# Altium project CT310高端控制盒核心板电路V1.2.PRJPCB
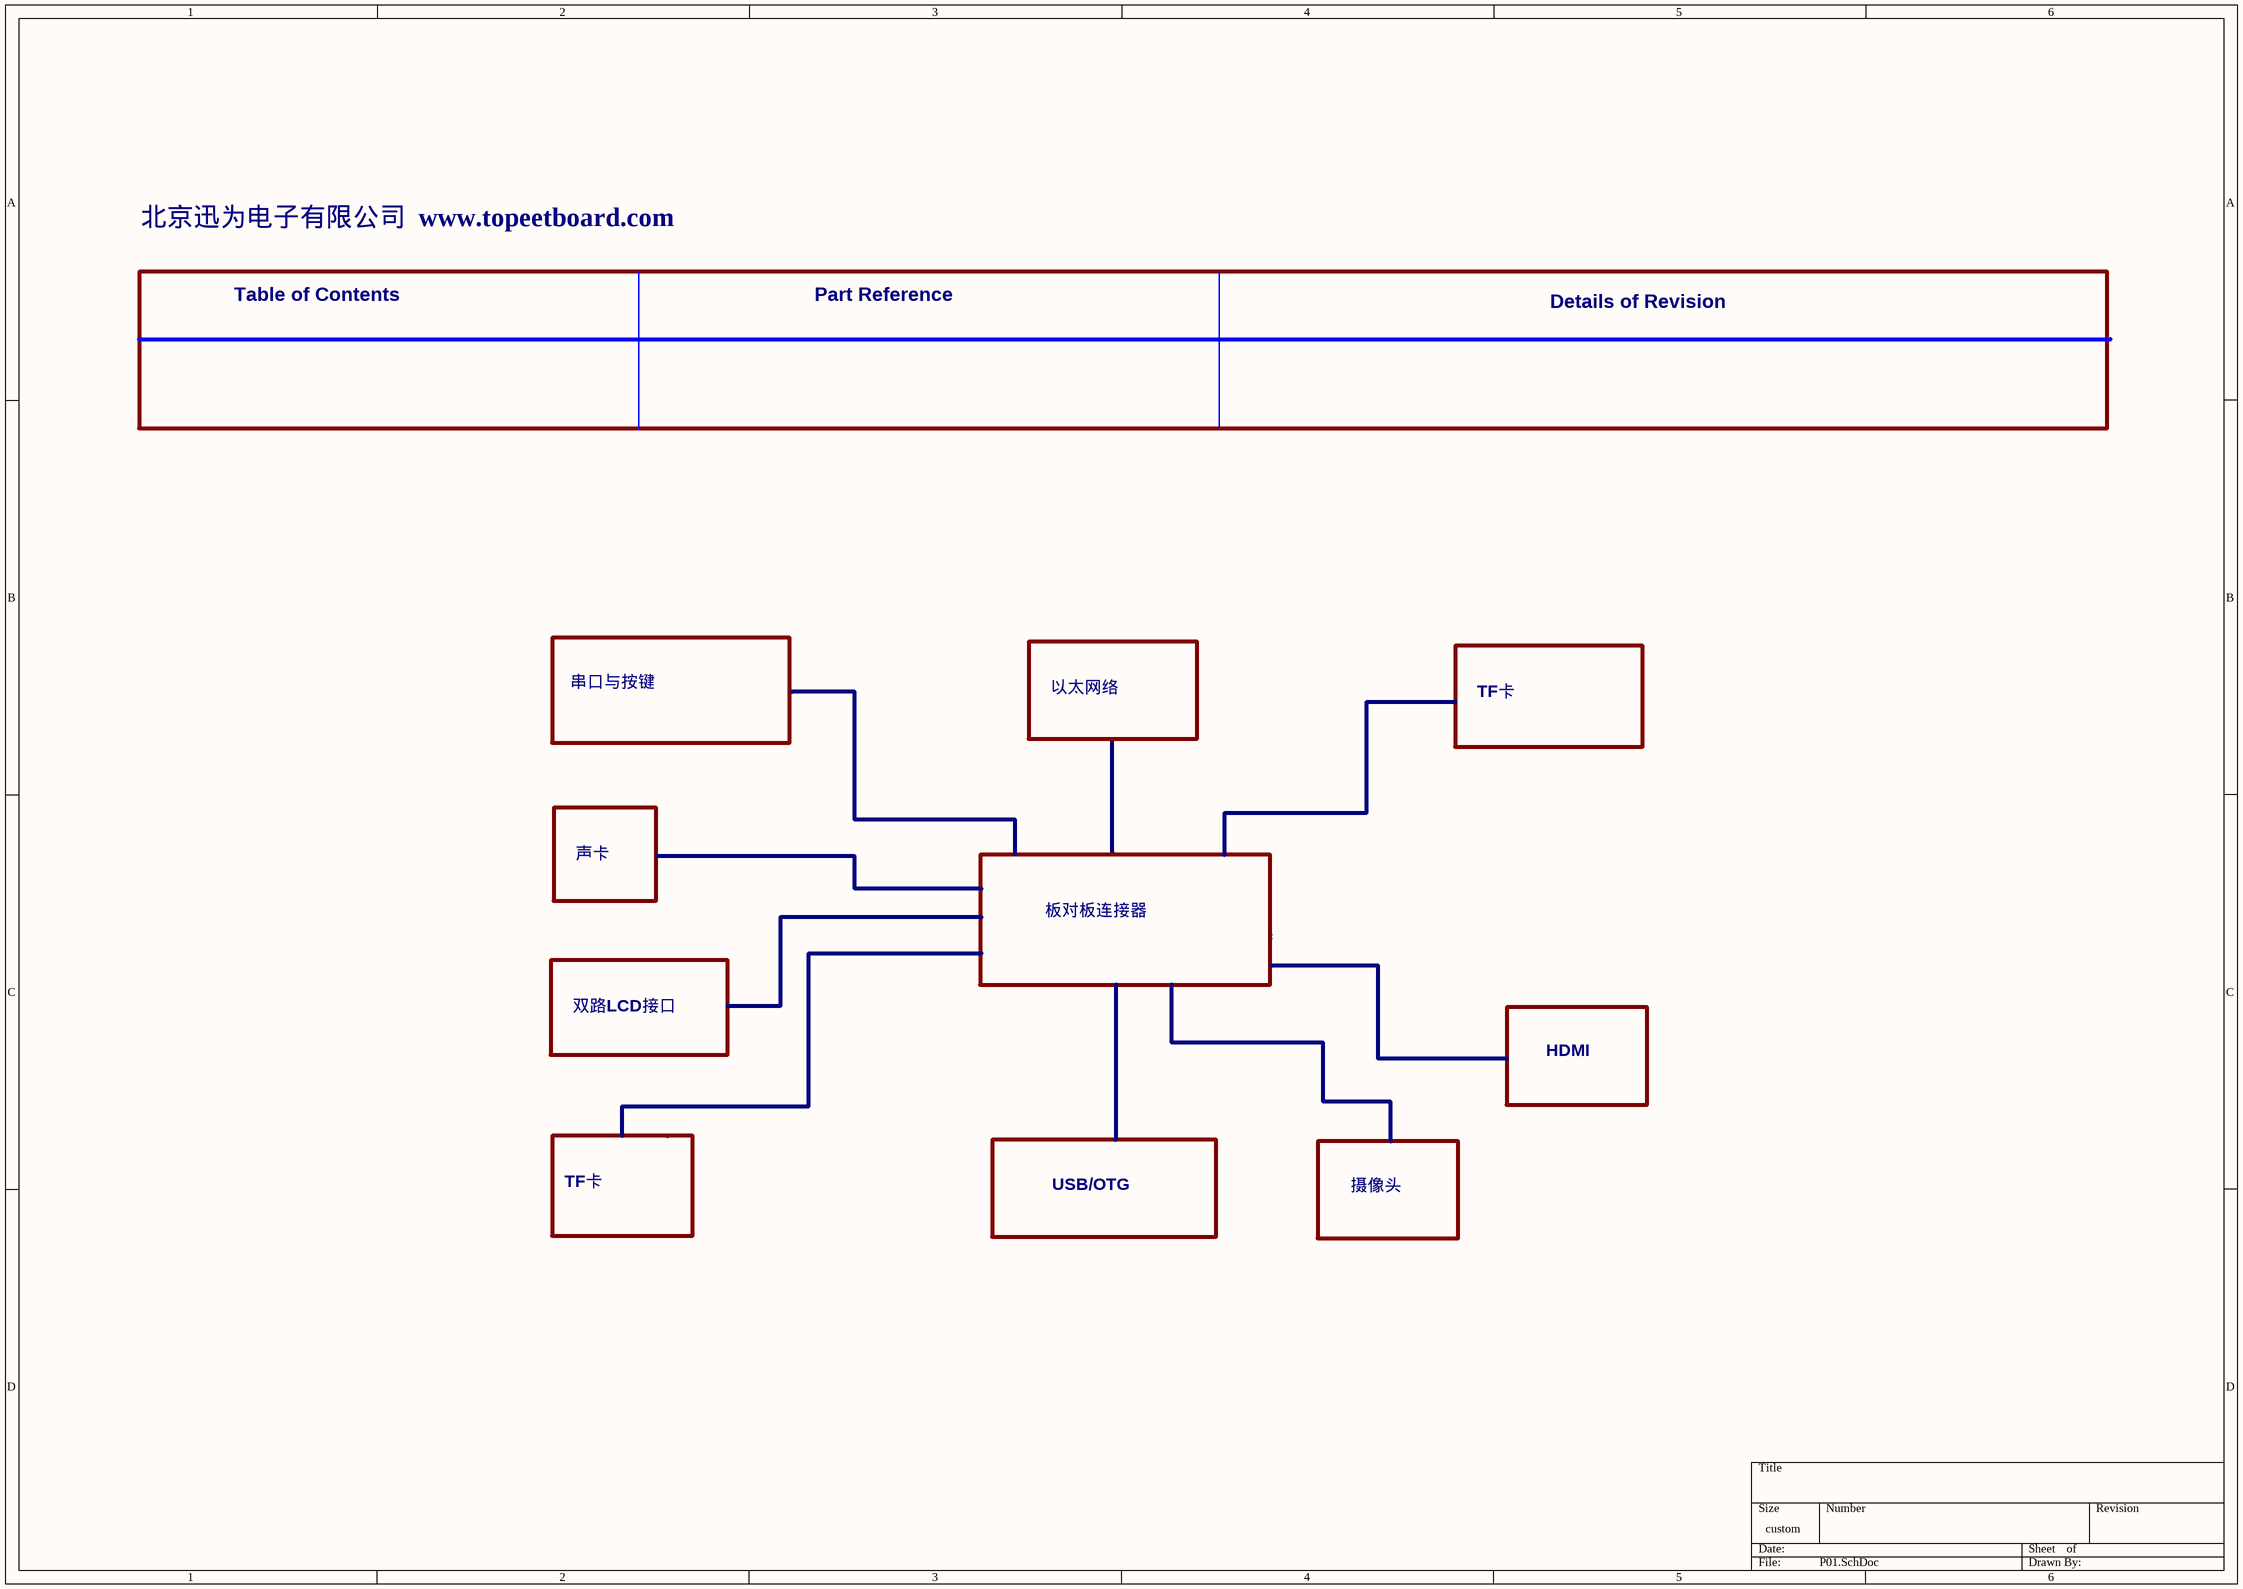
[diagram p0: P01.SchDoc]
9 sheets, 194 parts. Net scope: global (net labels, ports and power ports of the same name join across sheets).
Board file: CT310高端控制盒核心板电路V1.2.PcbDoc
Sheets:
  P01.SchDoc
  P02-DC_JACK.SchDoc
  P03-UARTs_KEY.SchDoc
  P04-NET.SchDoc
  P07-LCD.SchDoc
  P09-USB_JTAG.SchDoc
  P11-CAMERA AVIN.SchDoc
  P15-EXP_IO.SchDoc
  P16-Connector.SchDoc

## Sheet P01.SchDoc
size 420 x 297 mm

### Notes on the sheet
- 北京迅为电子有限公司  www.topeetboard.com
- Table of Contents
- Part Reference
- Details of Revision
- 串口与按键
- 以太网络
- TF卡
- 声卡
- 板对板连接器
- 双路LCD接口
- HDMI
- USB/OTG
- 摄像头

## Sheet P02-DC_JACK.SchDoc
size 594 x 420 mm
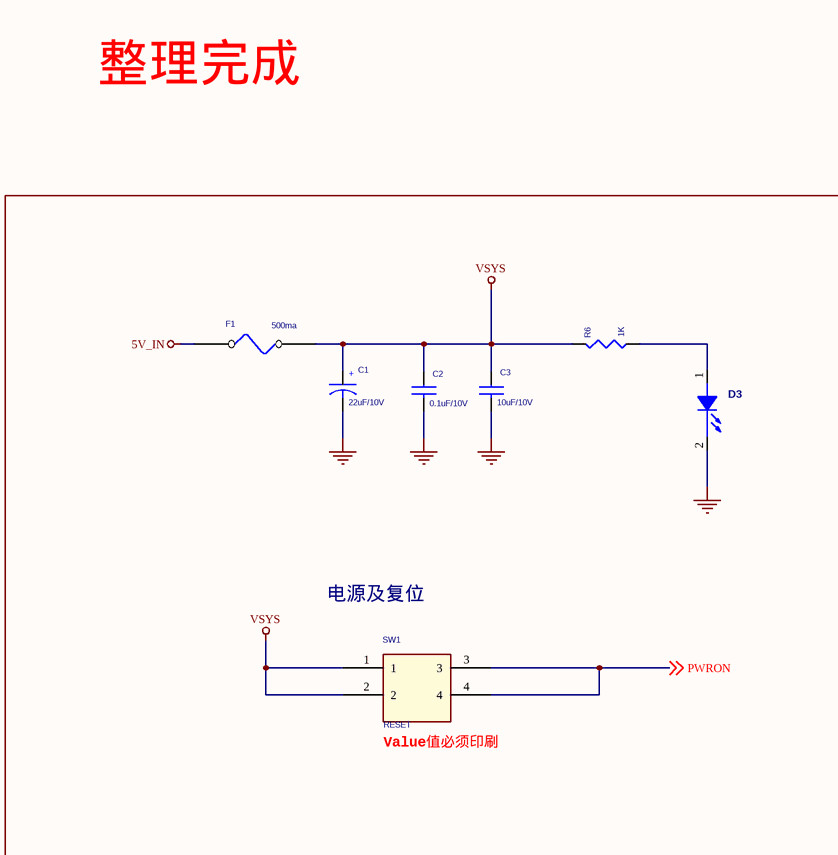
[diagram p1: P02-DC_JACK.SchDoc, top left]
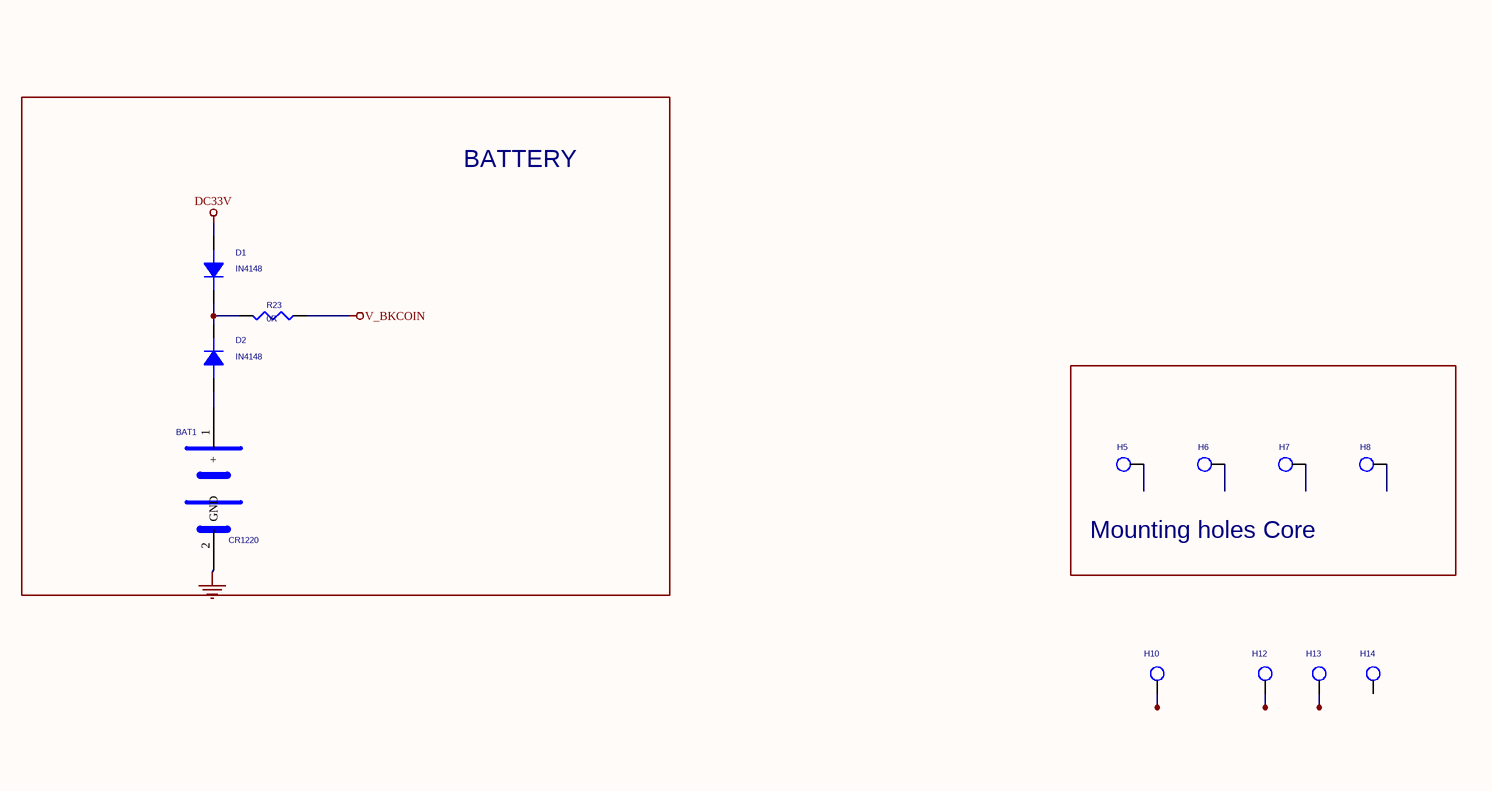
[diagram p2: P02-DC_JACK.SchDoc, top right]
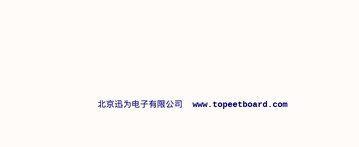
[diagram p3: P02-DC_JACK.SchDoc, bottom right]

### Parts
BAT1  CR1220  [BAT1]
C1  22uF/10V  [C1206-S]
C2  0.1uF/10V  [C0603-S]
C3  10uF/10V  [C0603-S]
D1  IN4148  [D1206]
D2  IN4148  [D1206]
D3  LED-Red (SMD 2012)  [LED0603]  (value not drawn)
F1  500ma  [F1812]
H5  TP_P0_0.8_D0  [HOLE2_7]  (value not drawn)
H6  TP_P0_0.8_D0  [hole2_7]  (value not drawn)
H7  TP_P0_0.8_D0  [hole2_7]  (value not drawn)
H8  TP_P0_0.8_D0  [hole2_7]  (value not drawn)
H10  TP_P0_0.8_D0  [HOLE2_7]  (value not drawn)
H12  TP_P0_0.8_D0  [HOLE2_7]  (value not drawn)
H13  TP_P0_0.8_D0  [HOLE2_7]  (value not drawn)
H14  TP_P0_0.8_D0  [HOLE2_7]  (value not drawn)
R6  1K  [R0603-S]
R23  0R  [R0603-S]
SW1  RESET  [SW4-SMD]

### Blocks framed on the sheet
电源及复位: C1-C3 D3 F1 R6 SW1
BATTERY: BAT1 D1 D2 R23
Mounting holes Core: H5-H8

### Nets
5V_IN: F1.1
DC33V: D1.1(A)
GND: BAT1.2(GND) C1.2 C2.2 C3.2 D3.2(CATHODE)
V_BKCOIN: R23.1
VSYS: C1.1 C2.1 C3.1 F1.2 R6.2 SW1.1 SW1.2
PWRON: SW1.3 SW1.4 ; off-sheet PWRON
NetBAT1_1: BAT1.1(+) D2.1(A)
NetD1_2: D1.2(K) D2.2(K) R23.2
NetD3_1: D3.1(ANODE) R6.1

Not connected (* = marked no-connect by the designer): H5 1; H6 1; H7 1; H8 1; H10 1; H12 1; H13 1; H14 1

### Notes on the sheet
- 整理完成
- (near SW1) Value值必须印刷
- 北京迅为电子有限公司  www.topeetboard.com
- (in symbol CT2012_0) +

### Library data of the parts
BAT1 = BATTERY_0
C1 = CT2012_0
C2 C3 = C1608_Dup1
D1 D2 = DIODE
D3 = LED-RED_SMD_1
F1 = FUSE
R6 = R1005_0_Dup1
R23 = R
SW1 = SW-4

## Sheet P03-UARTs_KEY.SchDoc
size 420 x 297 mm
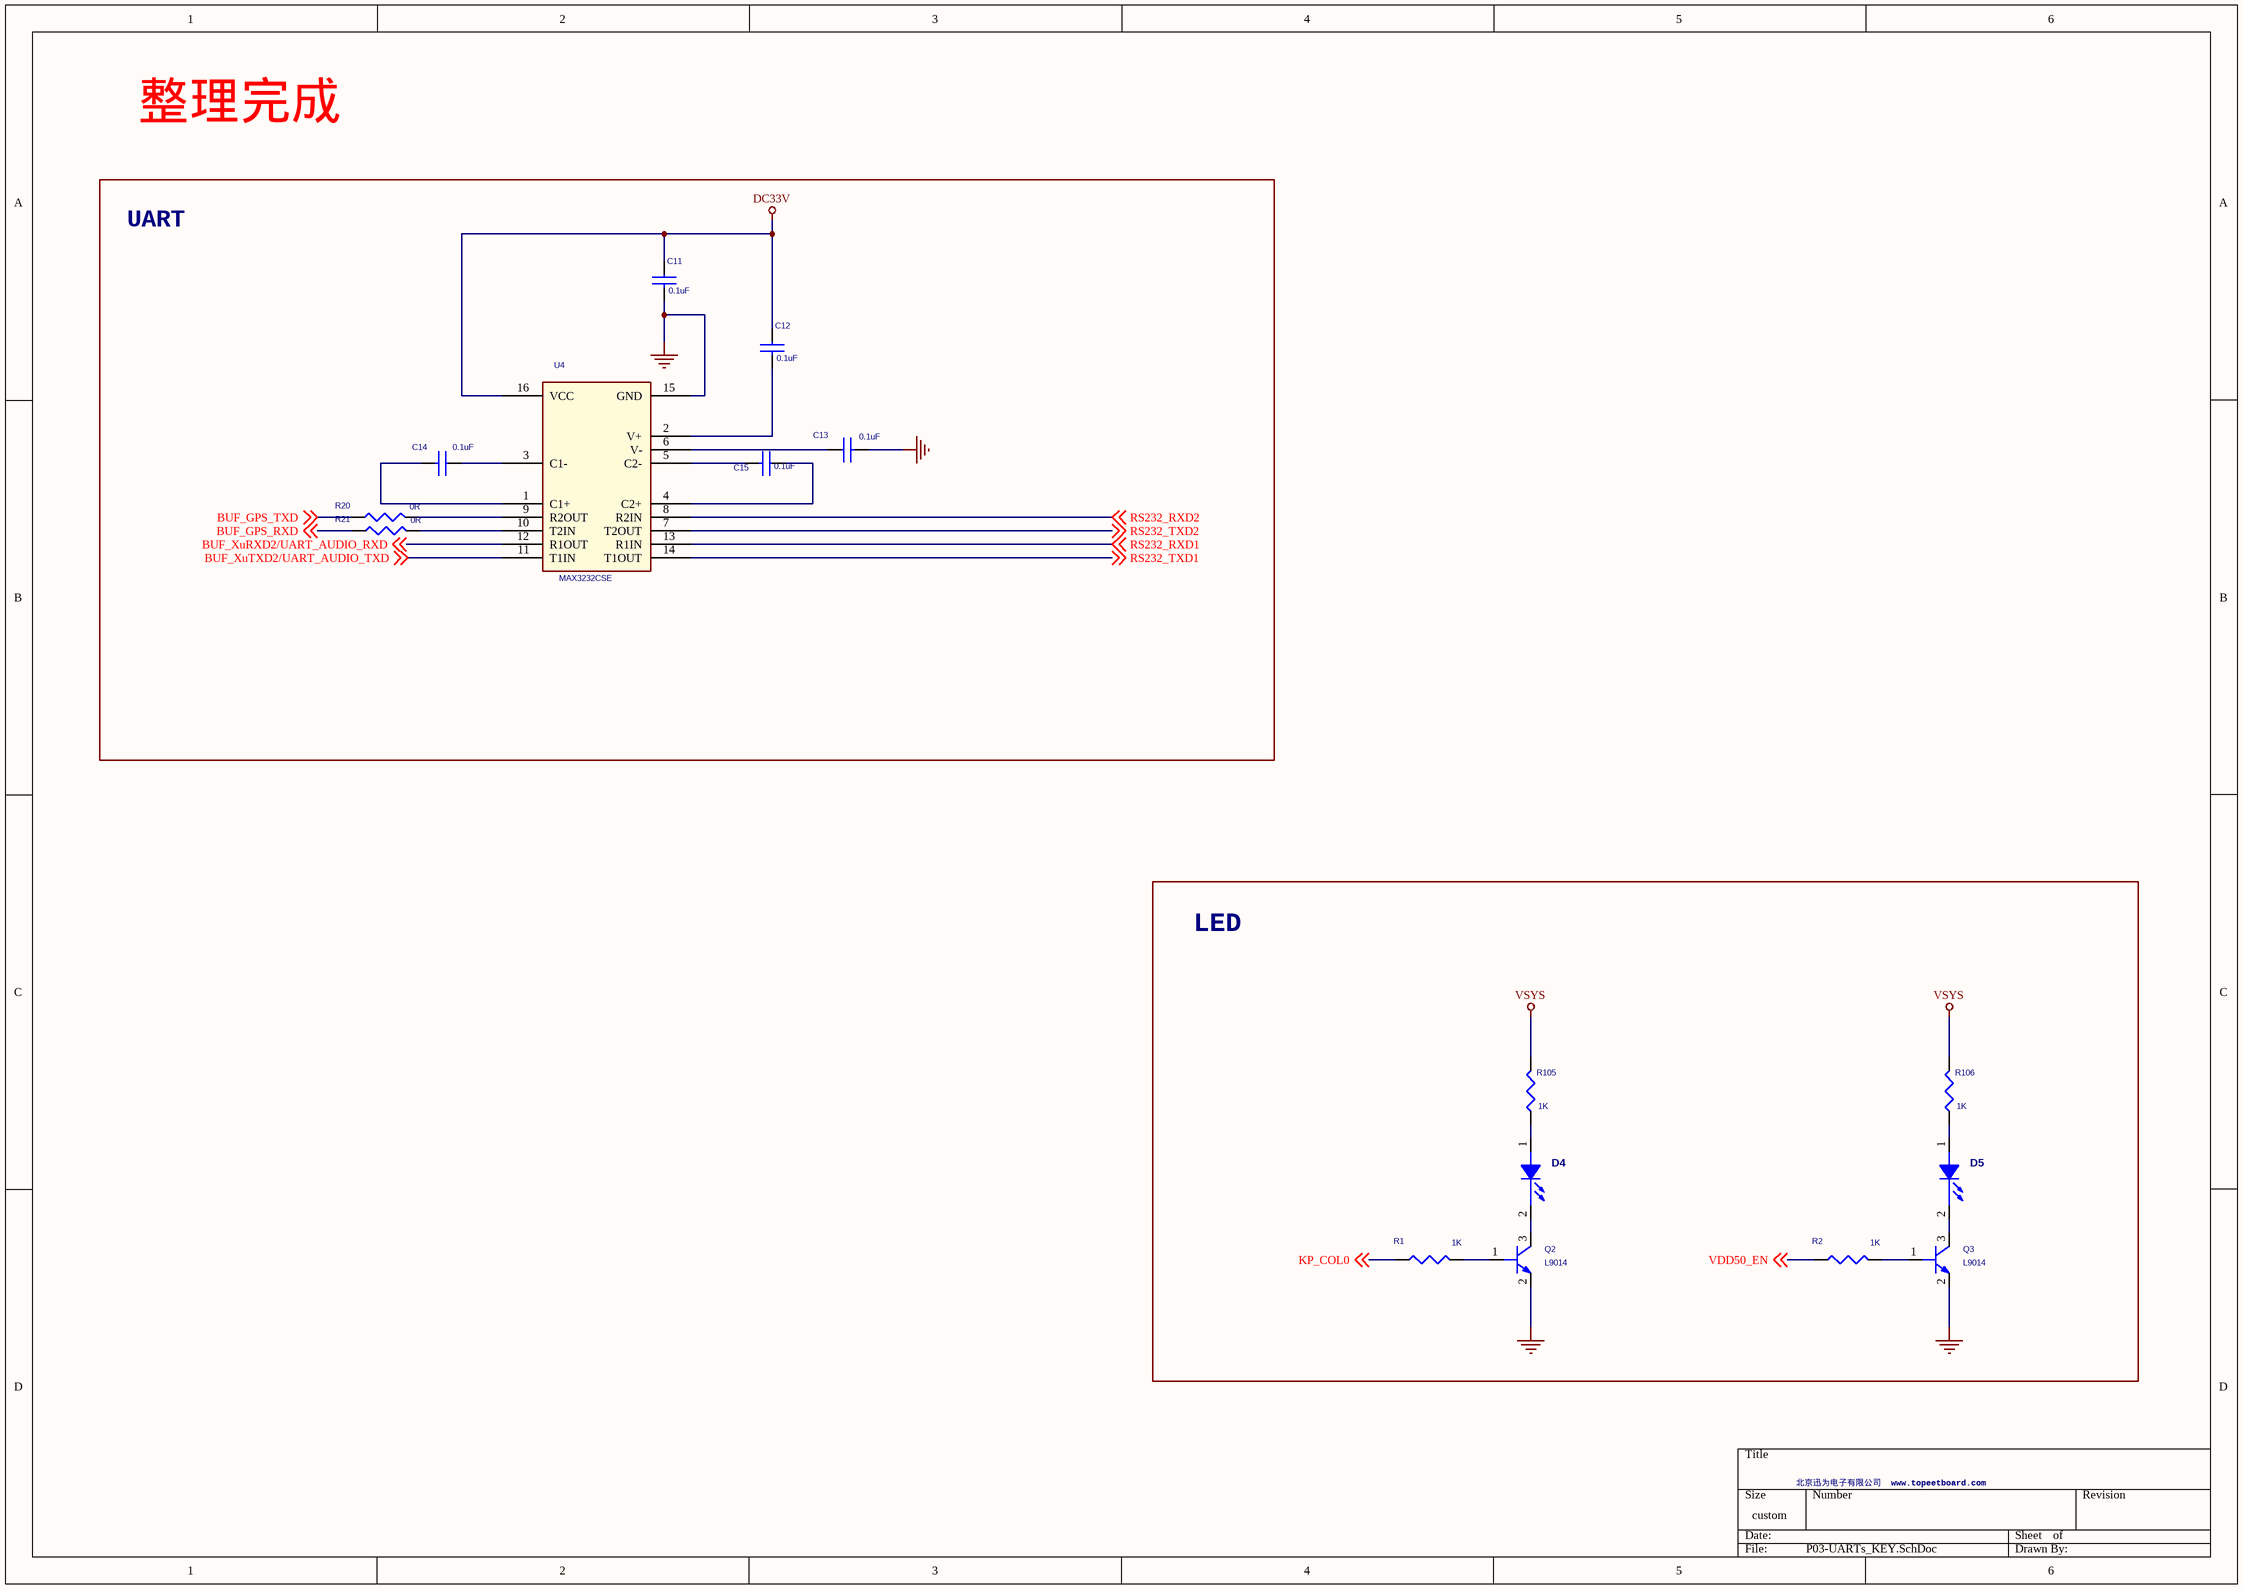
[diagram p4: P03-UARTs_KEY.SchDoc]

### Parts
C11  0.1uF  [C0603-S]
C12  0.1uF  [C0603-S]
C13  0.1uF  [C0603-S]
C14  0.1uF  [C0603-S]
C15  0.1uF  [C0603-S]
D4  LED-Red (SMD 2012)  [LED0603]  (value not drawn)
D5  LED-Red (SMD 2012)  [LED0603]  (value not drawn)
Q2  L9014  [SOT-23]
Q3  L9014  [SOT-23]
R1  1K  [R0603-S]
R2  1K  [R0603-S]
R20  0R  [R0603-S]
R21  0R  [R0603-S]
R105  1K  [R0603-S]
R106  1K  [R0603-S]
U4  MAX3232CSE  [SO-16]

### Blocks framed on the sheet
UART: C11-C15 R20 R21 U4
LED: D4 D5 Q2 Q3 R1 R2 R105 R106

### Nets
DC33V: C11.1 C12.1 U4.16(VCC)
GND: C11.2 C13.2 Q2.2(EMITTER) Q3.2(EMITTER) U4.15(GND)
VSYS: R105.2 R106.2
BUF_GPS_RXD: R21.1 ; off-sheet BUF_GPS_RXD
BUF_GPS_TXD: R20.1 ; off-sheet BUF_GPS_TXD
BUF_XuRXD2/UART_AUDIO_RXD: U4.12(R1OUT) ; off-sheet BUF_XuRXD2/UART_AUDIO_RXD
BUF_XuTXD2/UART_AUDIO_TXD: U4.11(T1IN) ; off-sheet BUF_XuTXD2/UART_AUDIO_TXD
KP_COL0: R1.2 ; off-sheet KP_COL0
RS232_RXD1: U4.13(R1IN) ; off-sheet RS232_RXD1
RS232_RXD2: U4.8(R2IN) ; off-sheet RS232_RXD2
RS232_TXD1: U4.14(T1OUT) ; off-sheet RS232_TXD1
RS232_TXD2: U4.7(T2OUT) ; off-sheet RS232_TXD2
VDD50_EN: R2.2 ; off-sheet VDD50_EN
NetC12_2: C12.2 U4.2(V+)
NetC13_1: C13.1 U4.6(V-)
NetC14_1: C14.1 U4.3(C1-)
NetC14_2: C14.2 U4.1(C1+)
NetC15_1: C15.1 U4.4(C2+)
NetC15_2: C15.2 U4.5(C2-)
NetD4_1: D4.1(ANODE) R105.1
NetD4_2: D4.2(CATHODE) Q2.3(COLLECTOR)
NetD5_1: D5.1(ANODE) R106.1
NetD5_2: D5.2(CATHODE) Q3.3(COLLECTOR)
NetQ2_1: Q2.1(BASE) R1.1
NetQ3_1: Q3.1(BASE) R2.1
NetR20_2: R20.2 U4.9(R2OUT)
NetR21_2: R21.2 U4.10(T2IN)

### Notes on the sheet
- 整理完成
- 北京迅为电子有限公司  www.topeetboard.com

### Library data of the parts
C11-C15 = C0603_0
D4 D5 = LED-RED_SMD_1
Q2 Q3 = L14P2/TO_1
R1 R2 R105 R106 = R1005_0_Dup1
R20 R21 = R1005_0
U4 = MAX3232EEAE

## Sheet P04-NET.SchDoc
size 817 x 513 mm
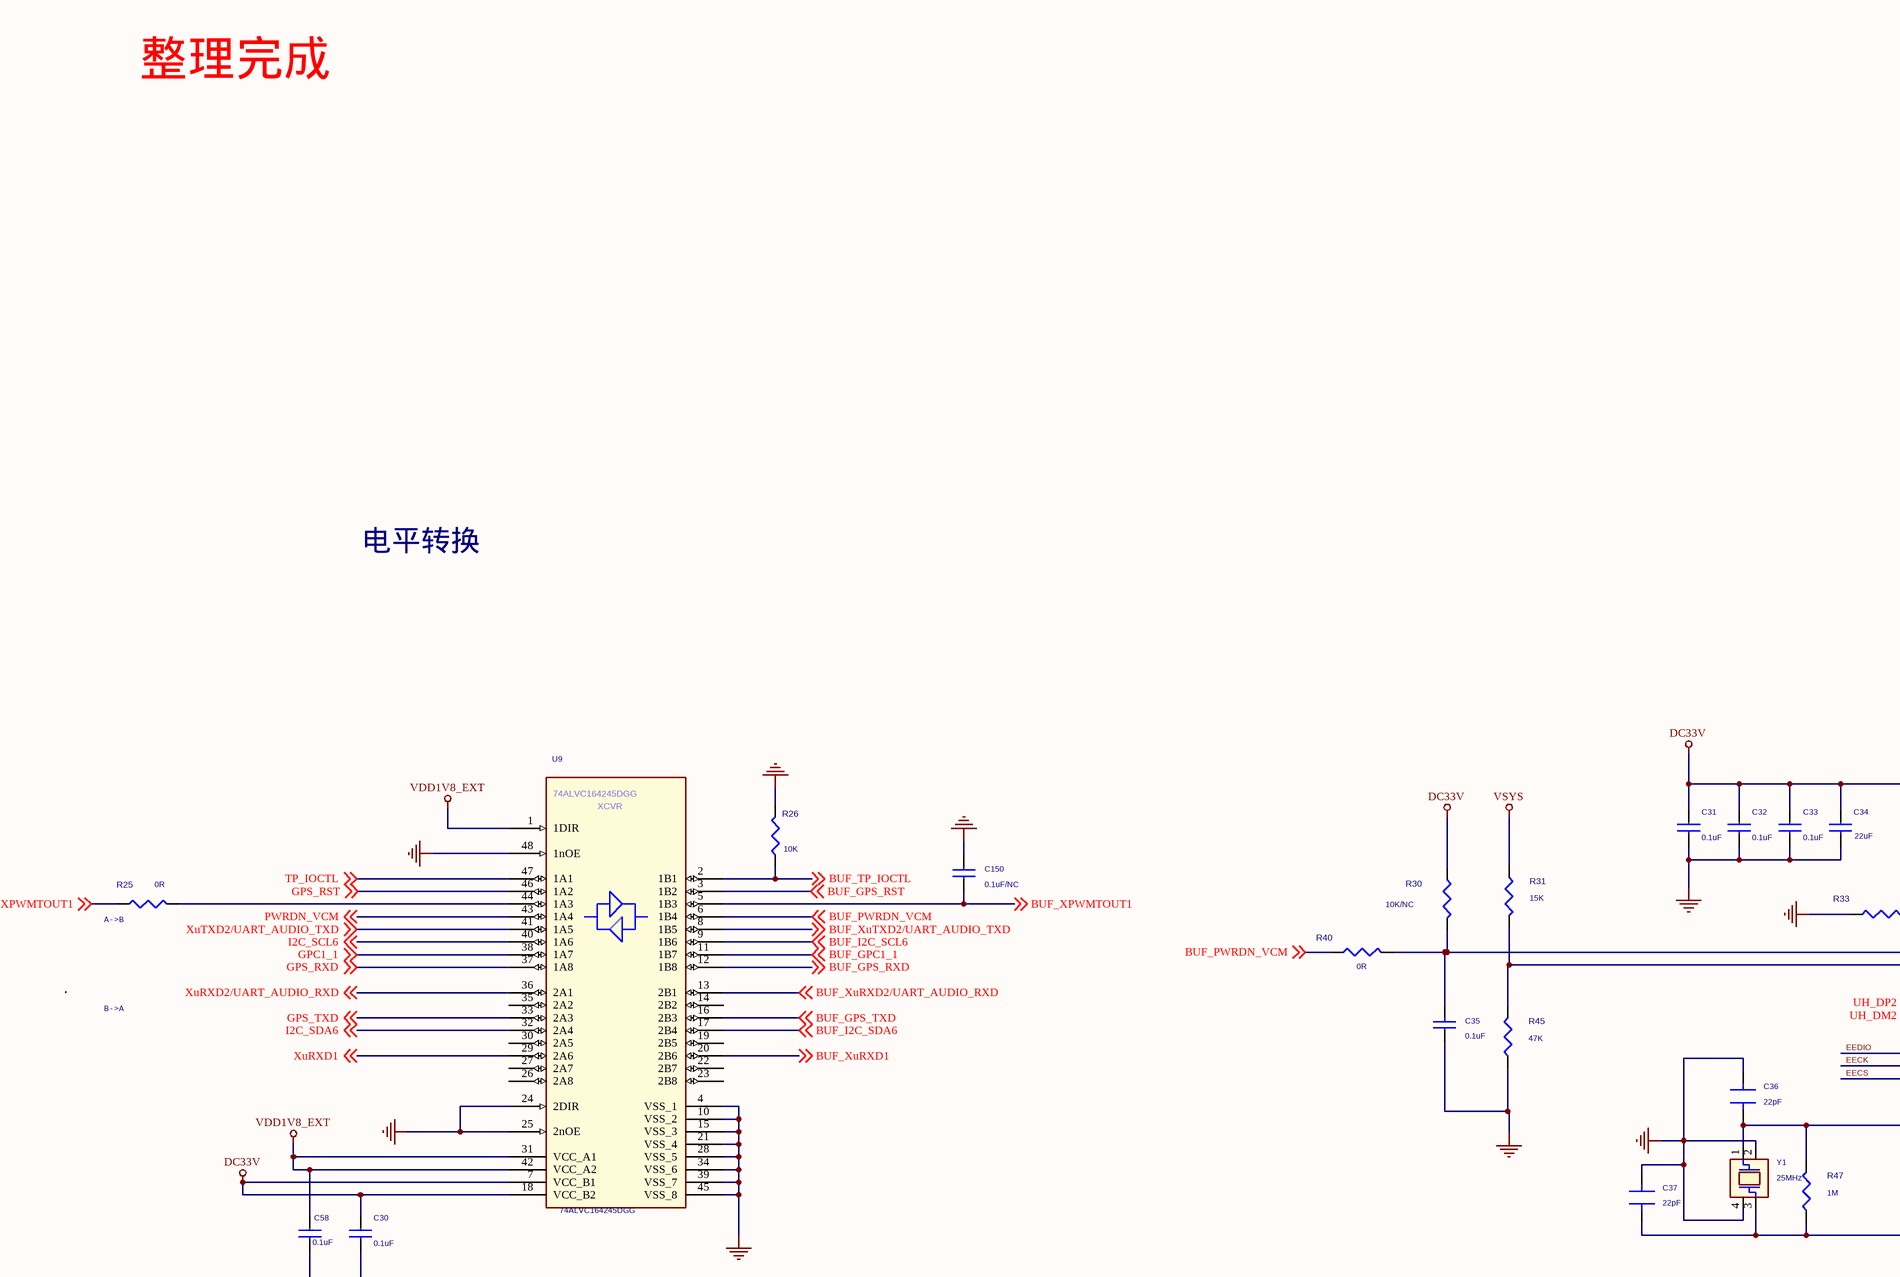
[diagram p5: P04-NET.SchDoc, top left]
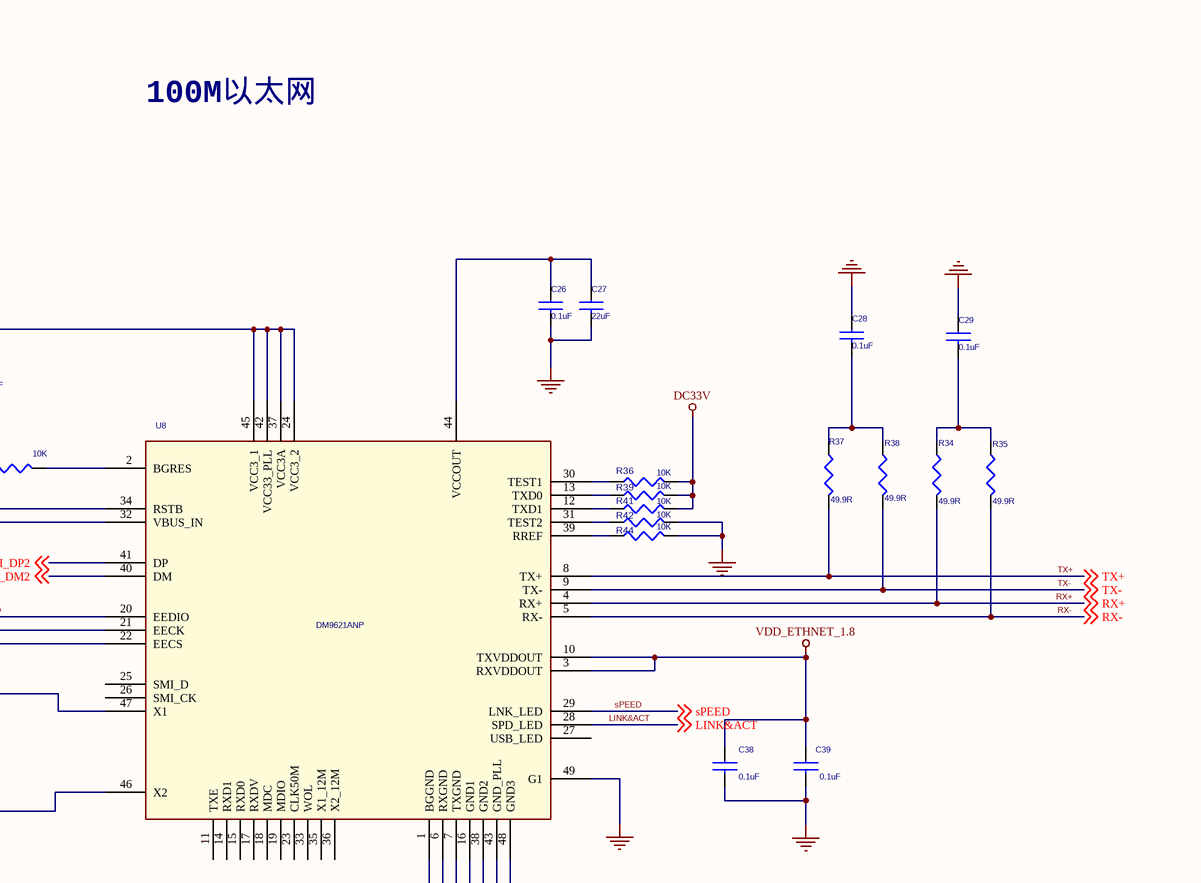
[diagram p6: P04-NET.SchDoc, top right]
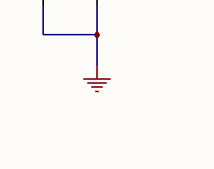
[diagram p7: P04-NET.SchDoc, bottom left]
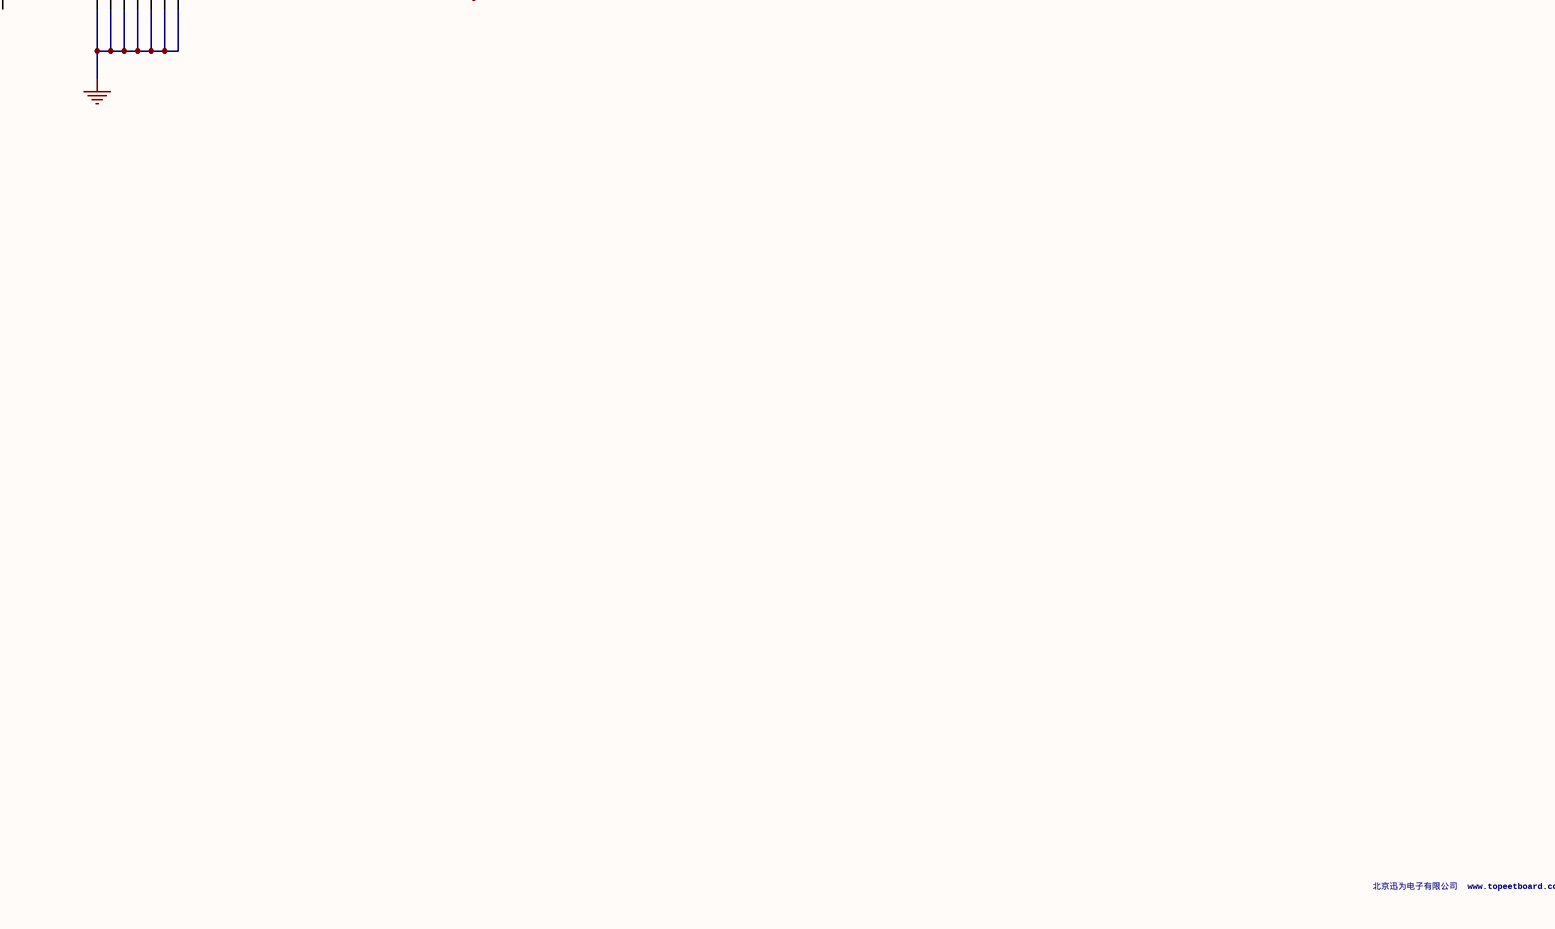
[diagram p8: P04-NET.SchDoc, bottom right]

### Parts
C26  0.1uF  [C0603-S]
C27  22uF  [C1206-S]
C28  0.1uF  [C0603-S]
C29  0.1uF  [C0603-S]
C30  0.1uF  [C0603-S]
C31  0.1uF  [C0603-S]
C32  0.1uF  [C0603-S]
C33  0.1uF  [C0603-S]
C34  22uF  [C1206-S]
C35  0.1uF  [C0603-S]
C36  22pF  [C0603-S]
C37  22pF  [C0603-S]
C38  0.1uF  [C0603-S]
C39  0.1uF  [C0603-S]
C58  0.1uF  [C0603-S]
C150  0.1uF/NC  [C0603-S]
R25  0R  [R0603-S]
R26  10K  [R0603-S]
R30  10K/NC  [R0603-S]
R31  15K  [R0603-S]
R33  10K  [R0603-S]
R34  49.9R  [R0805-S]
R35  49.9R  [R0805-S]
R36  10K  [R0603-S]
R37  49.9R  [R0805-S]
R38  49.9R  [R0805-S]
R39  10K  [R0603-S]
R40  0R  [R0603-S]
R41  10K  [R0603-S]
R42  10K  [R0603-S]
R44  10K  [R0603-S]
R45  47K  [R0603-S]
R47  1M  [R0603-S]
U8  DM9621ANP  [QFN48-050-0707LH]
U9  PART_NUMBER: 74ALVC164245DGG  [TSSOP_48]  (hidden comment: U-74ALVC164245DGG)
Y1  25MHz  [X4-2_5X3_2]

### Nets
DC33V: C30.1 C31.1 C32.1 C33.1 C34.1 R30.2 R36.1 R39.1 R41.1 U8.24(VCC3_2) U8.37(VCC3A) U8.42(VCC33_PLL) U8.45(VCC3_1) U9.7(VCC_B1) U9.18(VCC_B2)
GND: C26.2 C27.2 C28.1 C29.1 C30.2 C31.2 C32.2 C33.2 C34.2 C35.1 C36.2 C37.2 C38.2 C39.2 C58.2 C150.2 R26.1 R33.2 R42.1 R44.1 R45.2 U8.1(BGGND) U8.6(RXGND) U8.7(TXGND) U8.16(GND1) U8.38(GND2) U8.43(GND_PLL) U8.48(GND3) U8.49(G1) U9.4(VSS_1) U9.10(VSS_2) U9.15(VSS_3) U9.21(VSS_4) U9.24(2DIR) U9.25(2nOE) U9.28(VSS_5) U9.34(VSS_6) U9.39(VSS_7) U9.45(VSS_8) U9.48(1nOE) Y1.2(GND) Y1.4(GND)
VDD1V8_EXT: C58.1 U9.1(1DIR) U9.31(VCC_A1) U9.42(VCC_A2)
VDD_ETHNET_1.8: C38.1 C39.1 U8.3(RXVDDOUT) U8.10(TXVDDOUT)
VSYS: R31.2
BUF_GPC1_1: U9.11(1B7) ; off-sheet BUF_GPC1_1
BUF_GPS_RST: U9.3(1B2) ; off-sheet BUF_GPS_RST
BUF_GPS_RXD: U9.12(1B8) ; off-sheet BUF_GPS_RXD
BUF_GPS_TXD: U9.16(2B3) ; off-sheet BUF_GPS_TXD
BUF_I2C_SCL6: U9.9(1B6) ; off-sheet BUF_I2C_SCL6
BUF_I2C_SDA6: U9.17(2B4) ; off-sheet BUF_I2C_SDA6
BUF_PWRDN_VCM: R40.2 U9.6(1B4) ; off-sheet BUF_PWRDN_VCM
BUF_TP_IOCTL: R26.2 U9.2(1B1) ; off-sheet BUF_TP_IOCTL
BUF_XPWMTOUT1: C150.1 U9.5(1B3) ; off-sheet BUF_XPWMTOUT1
BUF_XuRXD1: U9.20(2B6) ; off-sheet BUF_XuRXD1
BUF_XuRXD2/UART_AUDIO_RXD: U9.13(2B1) ; off-sheet BUF_XuRXD2/UART_AUDIO_RXD
BUF_XuTXD2/UART_AUDIO_TXD: U9.8(1B5) ; off-sheet BUF_XuTXD2/UART_AUDIO_TXD
EECK: U8.21(EECK)
EECS: U8.22(EECS)
EEDIO: U8.20(EEDIO)
GPC1_1: U9.38(1A7) ; off-sheet GPC1_1
GPS_RST: U9.46(1A2) ; off-sheet GPS_RST
GPS_RXD: U9.37(1A8) ; off-sheet GPS_RXD
GPS_TXD: U9.33(2A3) ; off-sheet GPS_TXD
I2C_SCL6: U9.40(1A6) ; off-sheet I2C_SCL6
I2C_SDA6: U9.32(2A4) ; off-sheet I2C_SDA6
LINK&ACT: U8.28(SPD_LED) ; off-sheet LINK&ACT
PWRDN_VCM: U9.43(1A4) ; off-sheet PWRDN_VCM
RX+: R34.1 U8.4(RX+) ; off-sheet RX+
RX-: R35.1 U8.5(RX-) ; off-sheet RX-
sPEED: U8.29(LNK_LED) ; off-sheet sPEED
TP_IOCTL: U9.47(1A1) ; off-sheet TP_IOCTL
TX+: R37.1 U8.8(TX+) ; off-sheet TX+
TX-: R38.1 U8.9(TX-) ; off-sheet TX-
UH_DM2: U8.40(DM) ; off-sheet UH_DM2
UH_DP2: U8.41(DP) ; off-sheet UH_DP2
XPWMTOUT1: R25.2 ; off-sheet XPWMTOUT1
XuRXD1: U9.29(2A6) ; off-sheet XuRXD1
XuRXD2/UART_AUDIO_RXD: U9.36(2A1) ; off-sheet XuRXD2/UART_AUDIO_RXD
XuTXD2/UART_AUDIO_TXD: U9.41(1A5) ; off-sheet XuTXD2/UART_AUDIO_TXD
NetC26_1: C26.1 C27.1 U8.44(VCCOUT)
NetC28_2: C28.2 R37.2 R38.2
NetC29_2: C29.2 R34.2 R35.2
NetC35_2: C35.2 R30.1 R40.1 U8.34(RSTB)
NetC36_1: C36.1 R47.1 U8.47(X1) Y1.1(CIN)
NetC37_1: C37.1 R47.2 U8.46(X2) Y1.3(COUT)
NetR25_1: R25.1 U9.44(1A3)
NetR31_1: R31.1 R45.1 U8.32(VBUS_IN)
NetR33_1: R33.1 U8.2(BGRES)
NetR36_2: R36.2 U8.30(TEST1)
NetR39_2: R39.2 U8.13(TXD0)
NetR41_2: R41.2 U8.12(TXD1)
NetR42_2: R42.2 U8.31(TEST2)
NetR44_2: R44.2 U8.39(RREF)

Not connected (* = marked no-connect by the designer): U8 11(TXE) 14(RXD1) 15(RXD0) 17(RXDV) 18(MDC) 19(MDIO) 23(CLK50M) 25(SMI_D) 26(SMI_CK) 27(USB_LED) 33(WOL) 35(X1_12M) 36(X2_12M); U9 14(2B2) 19(2B5) 22(2B7) 23(2B8) 26(2A8) 27(2A7) 30(2A5) 35(2A2)

### Notes on the sheet
- 整理完成
- 电平转换
- 100M以太网
- (near R25) A->B
- B->A
- 北京迅为电子有限公司  www.topeetboard.com
- (in symbol U-74ALVC164245DGG) XCVR

### Library data of the parts
C26 C28-C33 C35 C38 C39 C150 = C1608_Dup1
C27 C34 = C1206_0
C36 C37 = CAP_1
C58 = C0402_0
R25 R26 R30 R31 R33 R36 R39-R42 R44 R45 R47 = RESISTOR_0
R34 R35 R37 R38 = R_Dup2: PAGE: DEBUG
U8 = DM9621NP_1
U9 = U-74ALVC164245DGG: IPN: A78685-001; MFGR: Philips; ValueP: IC,16 Bit XCVR,TSSOP48; DEVICE: 74ALVC164245DGG
Y1 = Y_24.576MHZ-5032

## Sheet P07-LCD.SchDoc
size 840 x 594 mm
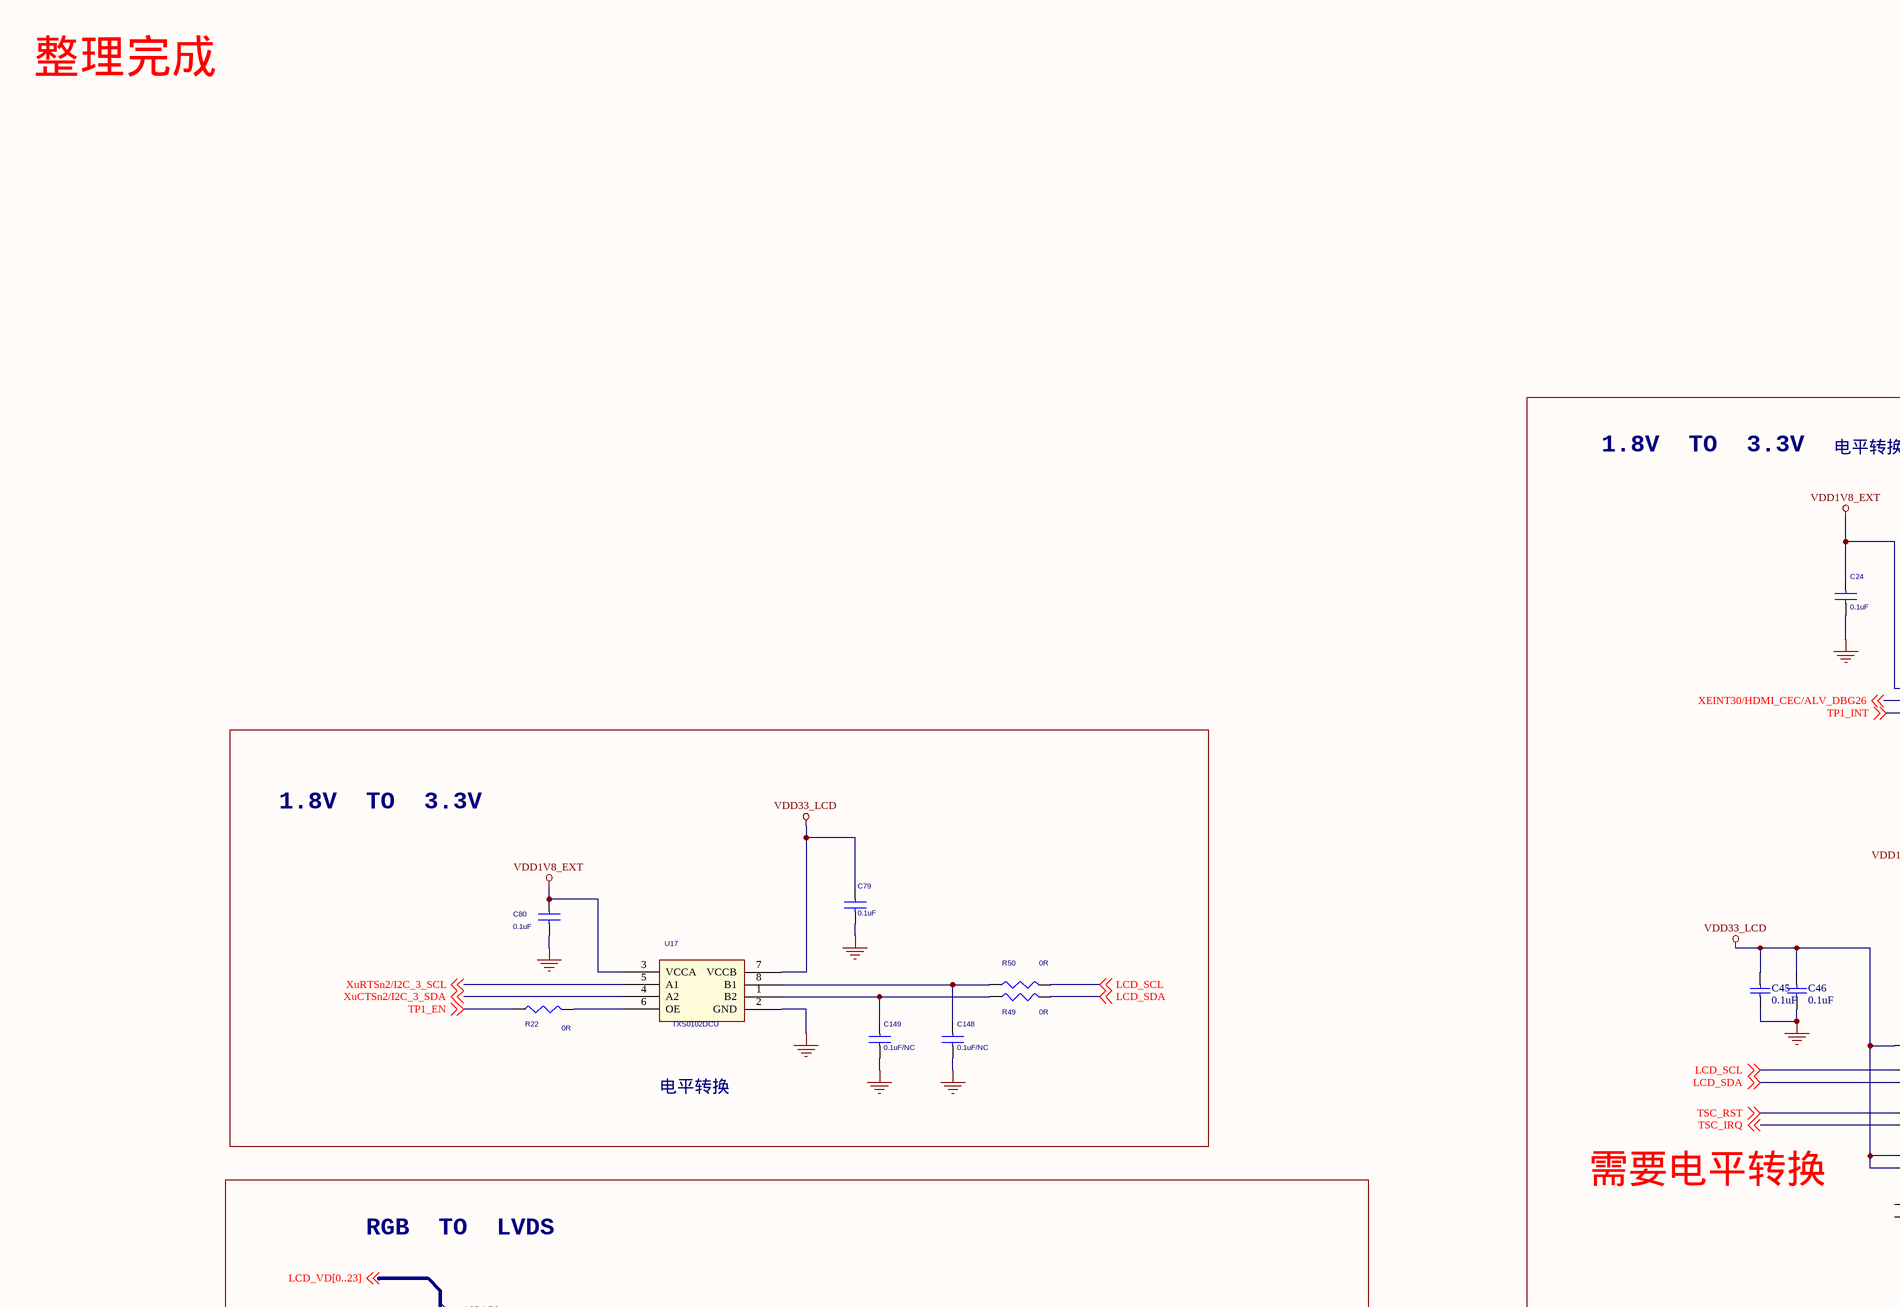
[diagram p9: P07-LCD.SchDoc, top left]
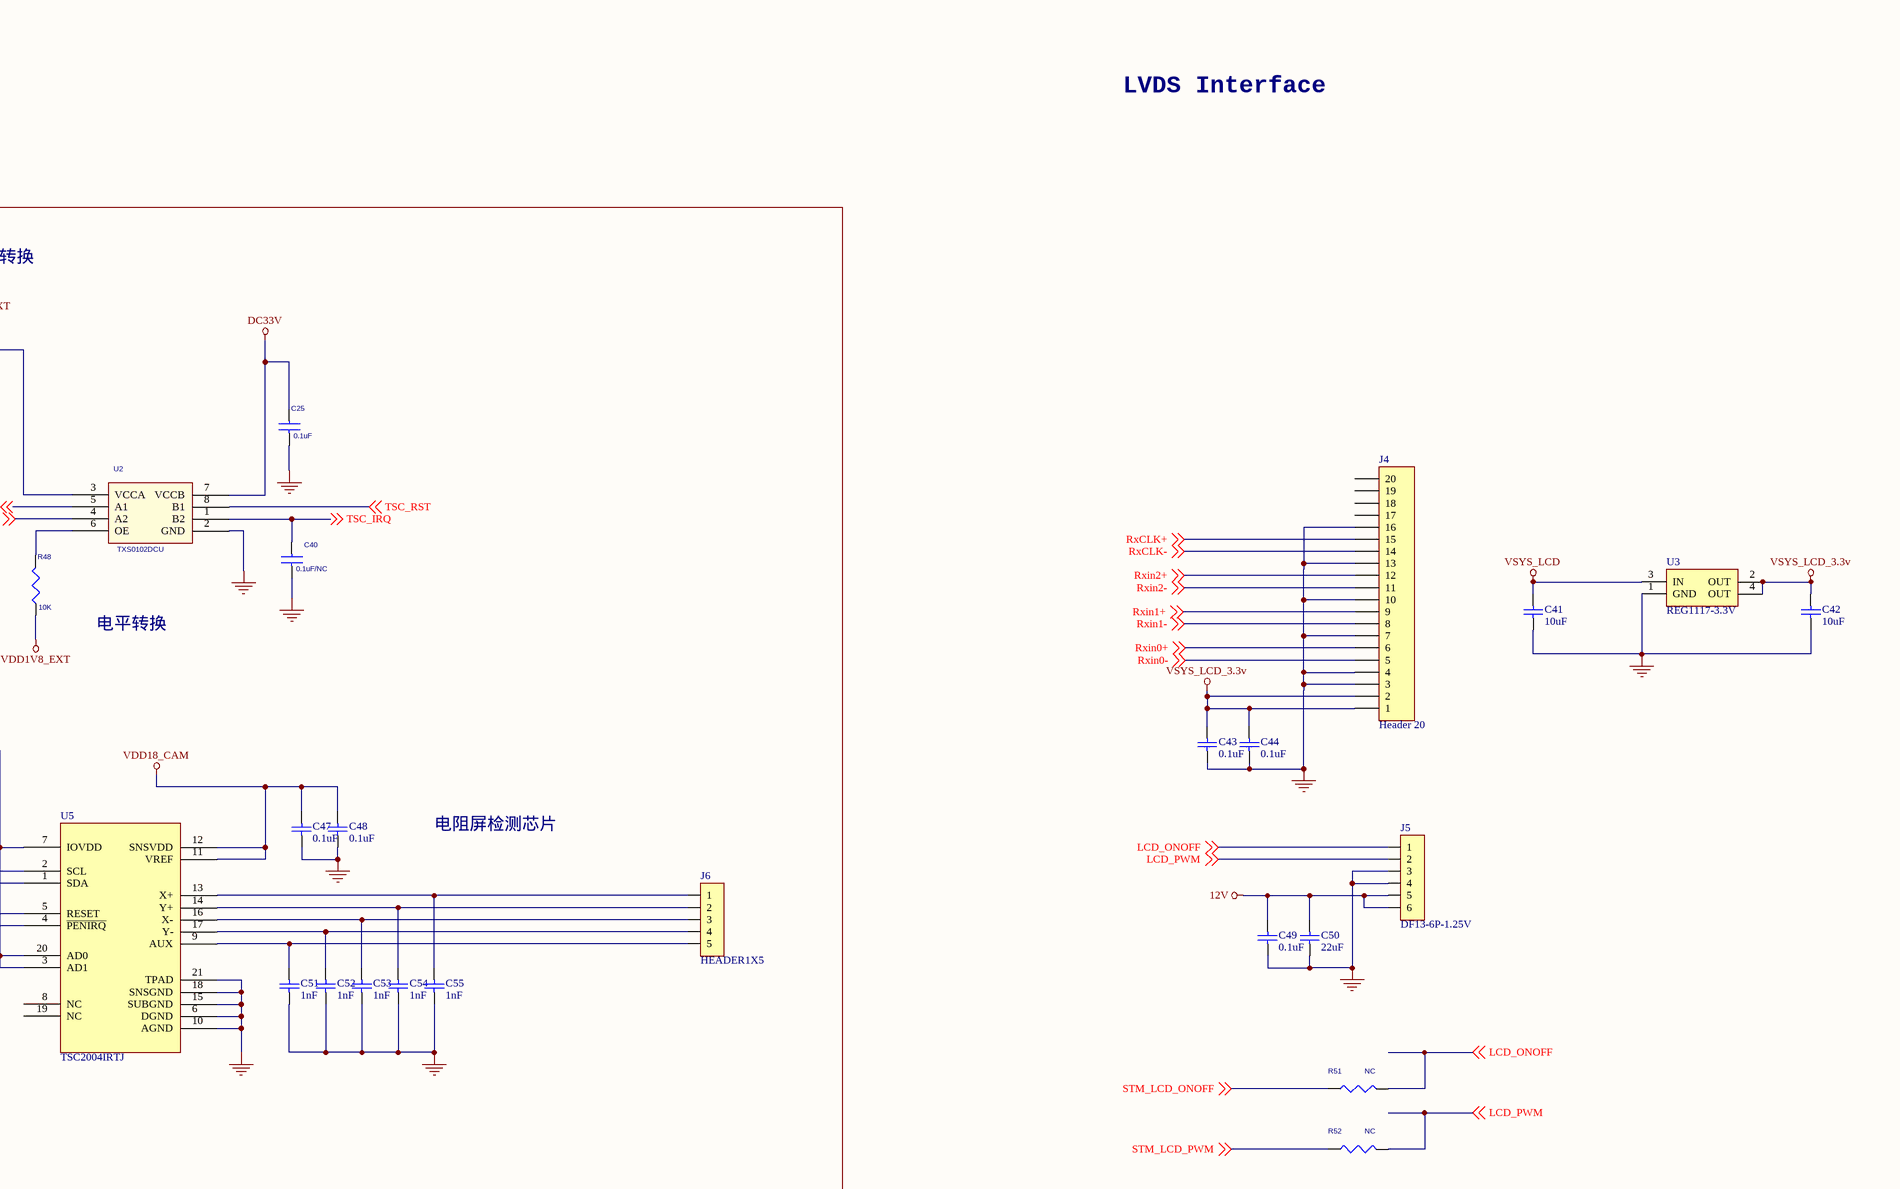
[diagram p10: P07-LCD.SchDoc, top right]
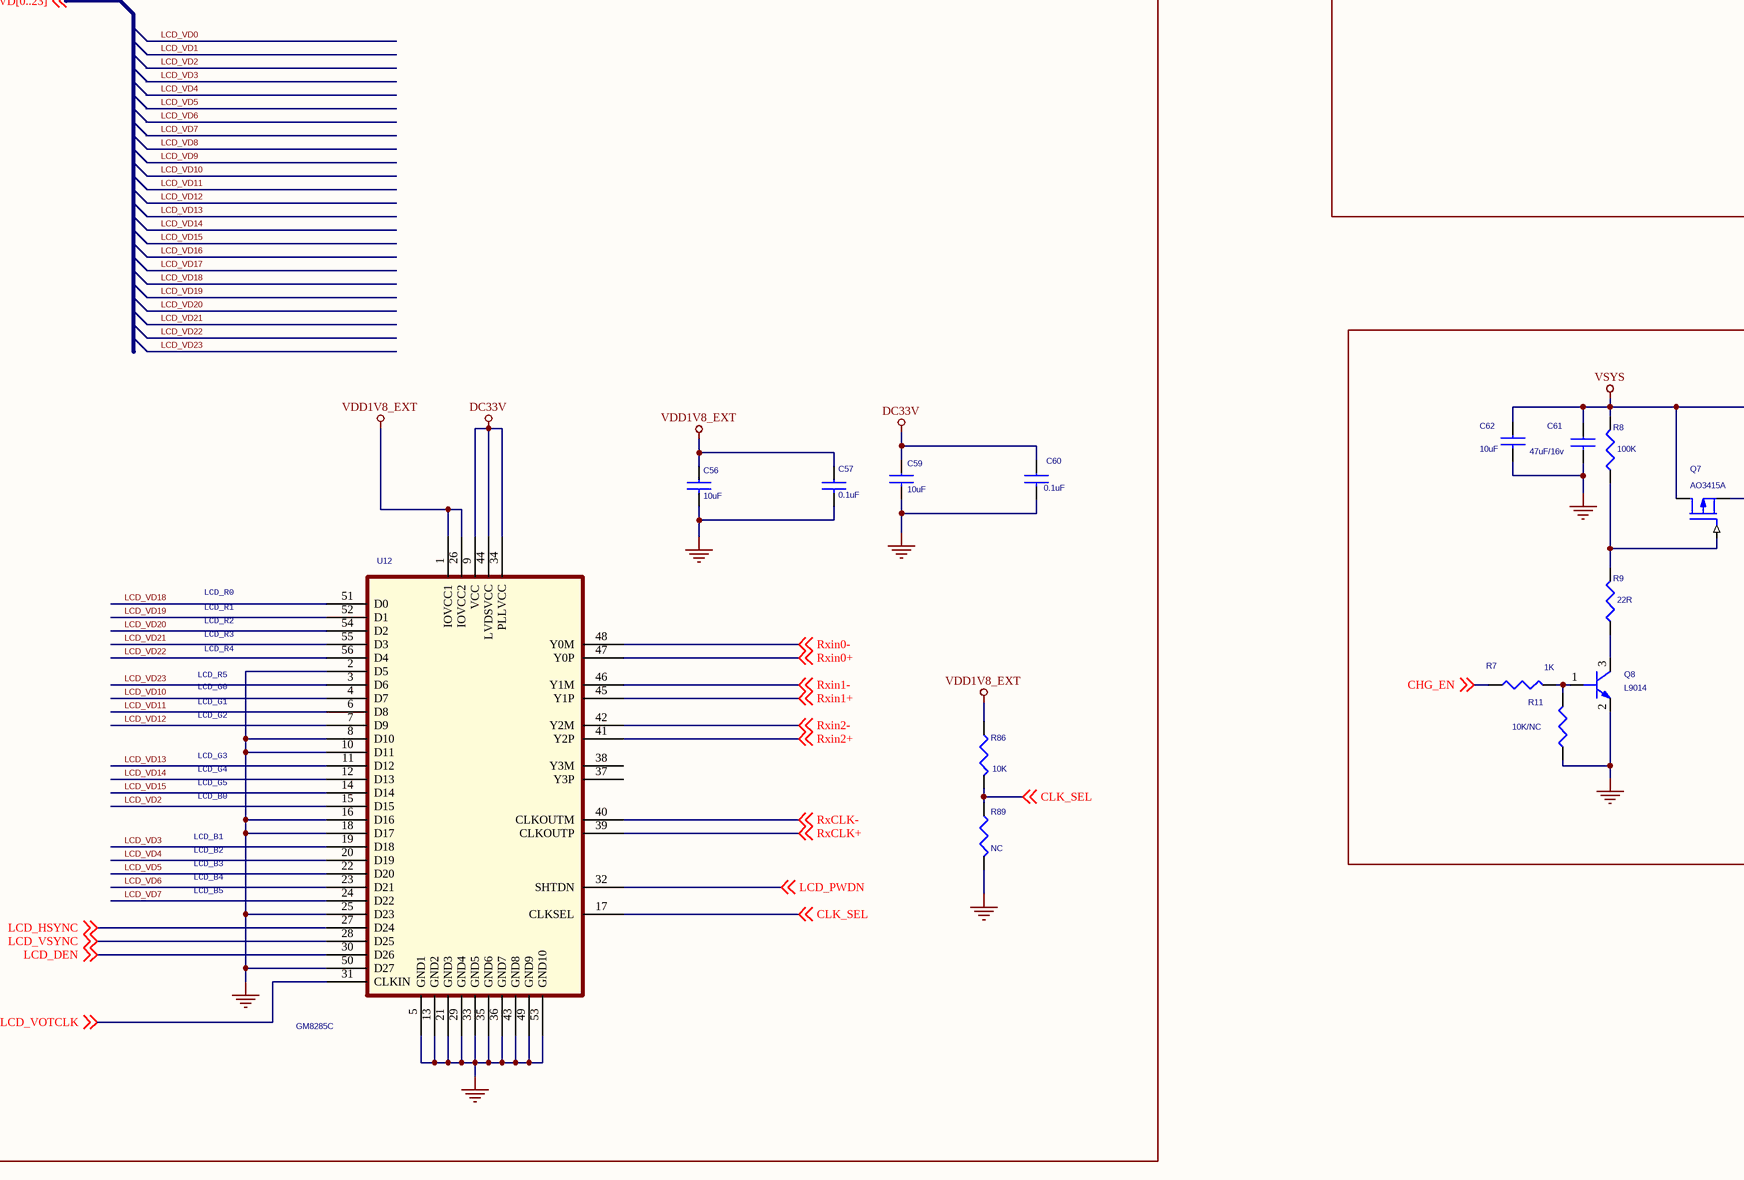
[diagram p11: P07-LCD.SchDoc, bottom left]
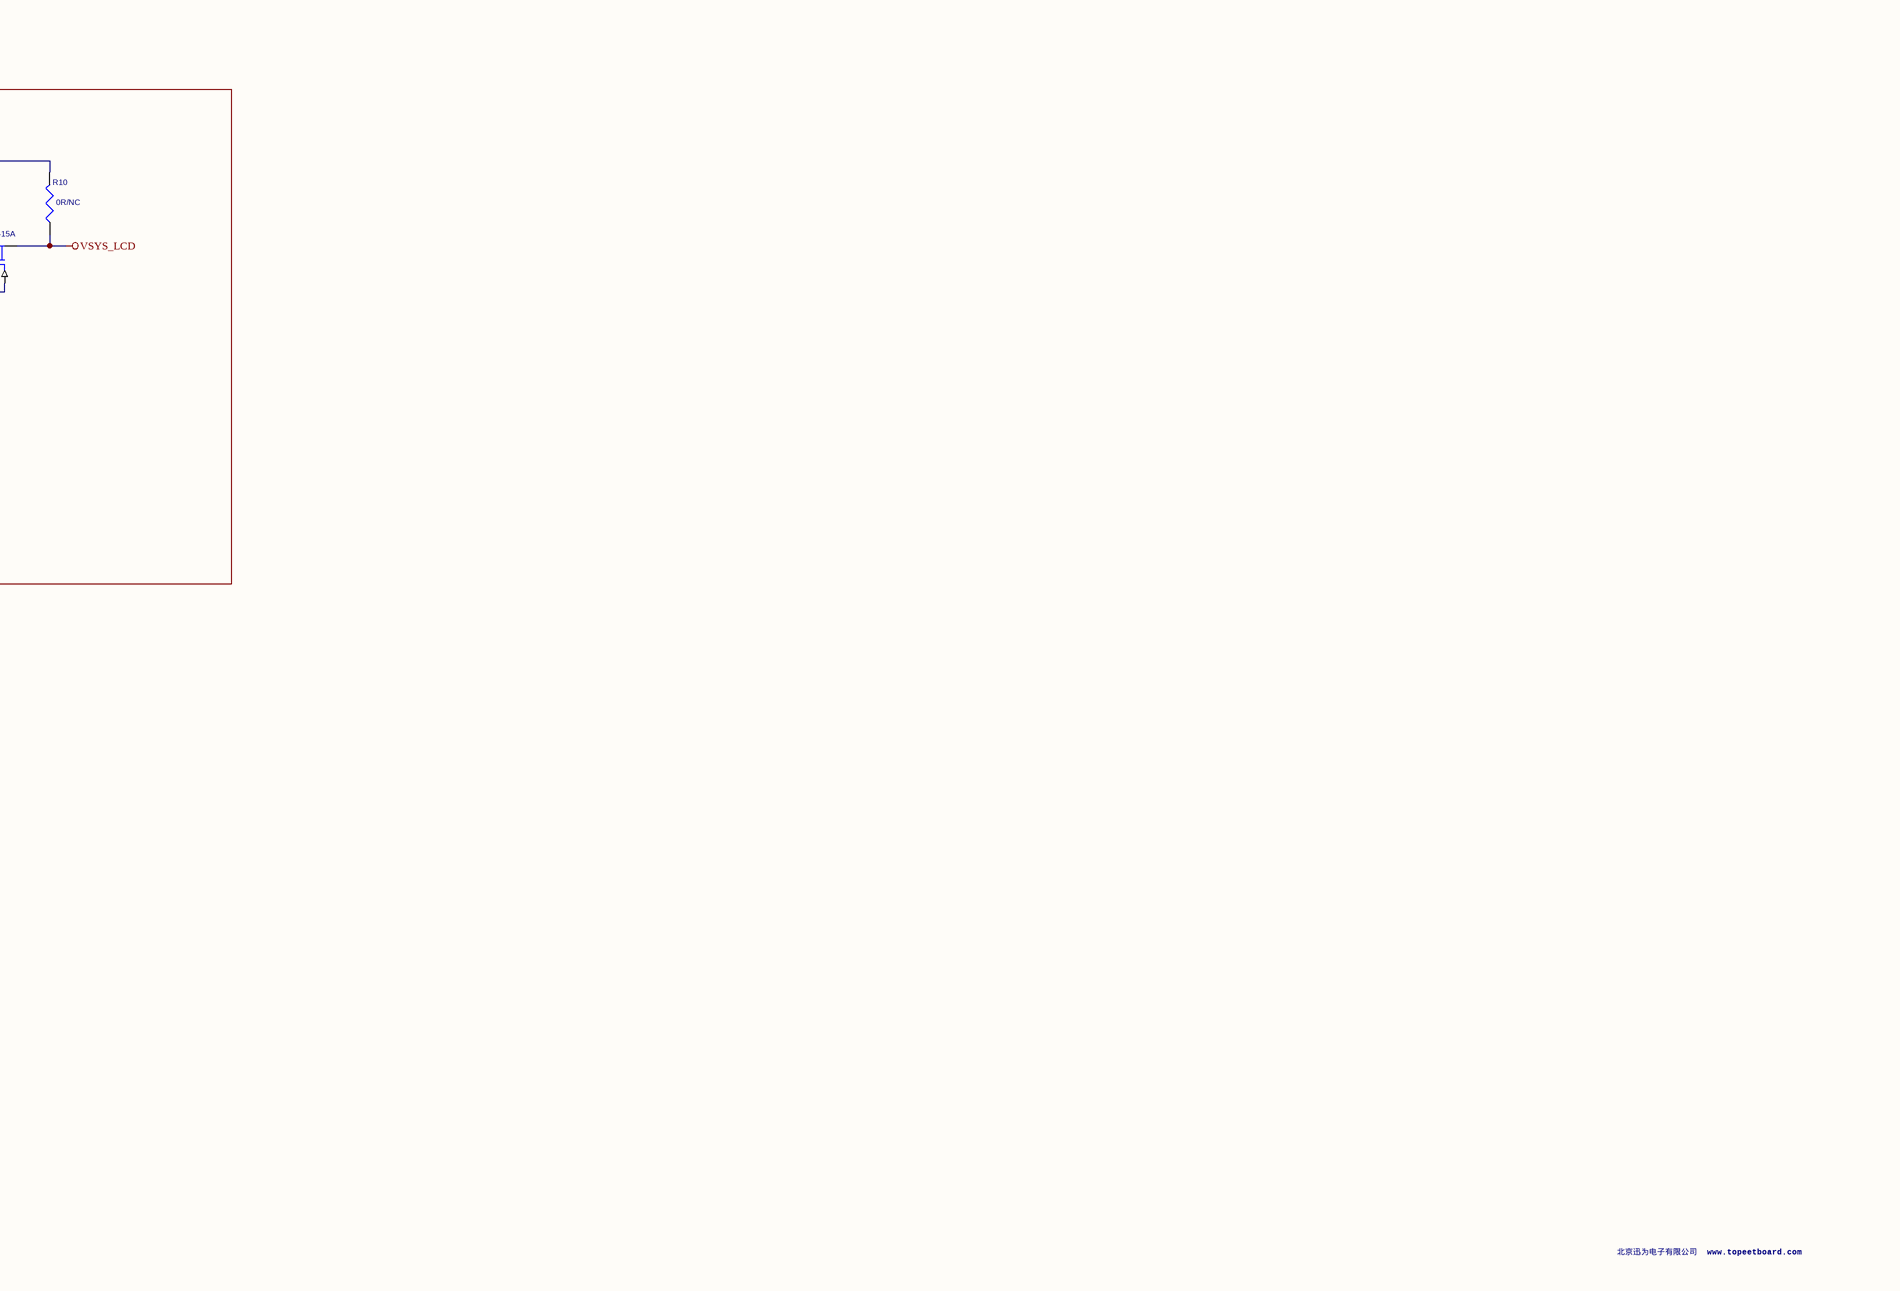
[diagram p12: P07-LCD.SchDoc, bottom right]

### Parts
C24  0.1uF  [C0603-S]
C25  0.1uF  [C0603-S]
C40  0.1uF/NC  [C0603-S]
C41  10uF  [C0603-s]
C42  10uF  [C0603-s]
C43  0.1uF  [C0603-s]
C44  0.1uF  [C0603-s]
C45  0.1uF  [C0603-S]
C46  0.1uF  [C0603-S]
C47  0.1uF  [C0603-S]
C48  0.1uF  [C0603-S]
C49  0.1uF  [C0603-s]
C50  22uF  [C0805-s]
C51  1nF  [C0603-S]
C52  1nF  [C0603-S]
C53  1nF  [C0603-S]
C54  1nF  [C0603-S]
C55  1nF  [C0603-S]
C56  10uF  [C0805-S]
C57  0.1uF  [C0603-S]
C59  10uF  [C0805-S]
C60  0.1uF  [C0603-S]
C61  47uF/16v  [C1206-S]
C62  10uF  [C0805-S]
C79  0.1uF  [C0603-S]
C80  0.1uF  [C0603-S]
C148  0.1uF/NC  [C0603-S]
C149  0.1uF/NC  [C0603-S]
J4  Header 20  [DF19G-20P]
J5  DF13-6P-1.25V  [DF13-6P-1.25V]
J6  HEADER1X5  [FFC/SM1.0-5]
Q7  AO3415A  [SOT-23]
Q8  L9014  [SOT-23]
R7  1K  [R0603-S]
R8  100K  [R0603-S]
R9  22R  [R0603-S]
R10  0R/NC  [R0603-S]
R11  10K/NC  [R0603-S]
R22  0R  [R0603-S]
R48  10K  [R0603-S]
R49  0R  [R0603-S]
R50  0R  [R0603-S]
R51  NC  [R0603-S]
R52  NC  [R0603-S]
R86  10K  [R0603-S]
R89  NC  [R0603-S]
U2  TXS0102DCU  [tssop8]
U3  REG1117-3.3V  [SOT-223]
U5  TSC2004IRTJ  [QFN20]
U12  GM8285C  [TSSOP56]
U17  TXS0102DCU  [tssop8]

### Blocks framed on the sheet
需要电平转换: C24 C25 C40 C45-C48 C51-C55 J6 R48 U2 U5
1.8V  TO  3.3V: C79 C80 C148 C149 R22 R49 R50 U17
RGB  TO  LVDS: C56 C57 C59 C60 R86 R89 U12

### Nets
12V: C49.2 C50.2 J5.5 J5.6
DC33V: C25.1 C59.1 C60.1 U2.7(VCCB) U12.9(VCC) U12.34(PLLVCC) U12.44(LVDSVCC)
GND: C24.2 C25.2 C40.2 C41.1 C42.1 C43.1 C44.1 C45.1 C46.1 C47.1 C48.1 C49.1 C50.1 C51.1 C52.1 C53.1 C54.1 C55.1 C56.2 C57.2 C59.2 C60.2 C61.2 C62.2 C79.2 C80.2 C148.2 C149.2 J4.3 J4.4 J4.7 J4.10 J4.13 J4.16 J5.3 J5.4 Q8.2(EMITTER) R11.2 R89.2 U2.2(GND) U3.1(GND) U5.6(DGND) U5.10(AGND) U5.15(SUBGND) U5.18(SNSGND) U5.21(TPAD) U12.2(D5) U12.5(GND1) U12.8(D10) U12.10(D11) U12.13(GND2) U12.16(D16) U12.18(D17) U12.21(GND3) U12.25(D23) U12.29(GND4) U12.33(GND5) U12.35(GND6) U12.36(GND7) U12.43(GND8) U12.49(GND9) U12.50(D27) U12.53(GND10) U17.2(GND)
VDD1V8_EXT: C24.1 C56.1 C57.1 C80.1 R48.1 R86.1 U2.3(VCCA) U12.1(IOVCC1) U12.26(IOVCC2) U17.3(VCCA)
VDD18_CAM: C47.2 C48.2 U5.11(VREF) U5.12(SNSVDD)
VDD33_LCD: C45.2 C46.2 C79.1 U5.3(AD1) U5.7(IOVDD) U5.20(AD0) U17.7(VCCB)
VSYS: C61.1 C62.1 Q7.2(DRAIN) R8.1 R10.1
VSYS_LCD: C41.2 Q7.3(SOURCE) R10.2 U3.3(IN)
VSYS_LCD_3.3v: C42.2 C43.2 C44.2 J4.1 J4.2 U3.2(OUT) U3.4(OUT)
CHG_EN: R7.2 ; off-sheet CHG_EN
CLK_SEL: R86.2 R89.1 U12.17(CLKSEL) ; off-sheet CLK_SEL
LCD_DEN: U12.30(D26) ; off-sheet LCD_DEN
LCD_HSYNC: U12.27(D24) ; off-sheet LCD_HSYNC
LCD_ONOFF: J5.1 R51.2 ; off-sheet LCD_ONOFF
LCD_PWDN: U12.32(SHTDN) ; off-sheet LCD_PWDN
LCD_PWM: J5.2 R52.2 ; off-sheet LCD_PWM
LCD_SCL: R50.2 U5.2(SCL) ; off-sheet LCD_SCL
LCD_SDA: R49.2 U5.1(SDA) ; off-sheet LCD_SDA
LCD_VD2: U12.15(D15)
LCD_VD3: U12.19(D18)
LCD_VD4: U12.20(D19)
LCD_VD5: U12.22(D20)
LCD_VD6: U12.23(D21)
LCD_VD7: U12.24(D22)
LCD_VD10: U12.4(D7)
LCD_VD11: U12.6(D8)
LCD_VD12: U12.7(D9)
LCD_VD13: U12.11(D12)
LCD_VD14: U12.12(D13)
LCD_VD15: U12.14(D14)
LCD_VD18: U12.51(D0)
LCD_VD19: U12.52(D1)
LCD_VD20: U12.54(D2)
LCD_VD21: U12.55(D3)
LCD_VD22: U12.56(D4)
LCD_VD23: U12.3(D6)
LCD_VOTCLK: U12.31(CLKIN) ; off-sheet LCD_VOTCLK
LCD_VSYNC: U12.28(D25) ; off-sheet LCD_VSYNC
RxCLK+: J4.15 U12.39(CLKOUTP) ; off-sheet RxCLK+
RxCLK-: J4.14 U12.40(CLKOUTM) ; off-sheet RxCLK-
Rxin0+: J4.6 U12.47(Y0P) ; off-sheet Rxin0+
Rxin0-: J4.5 U12.48(Y0M) ; off-sheet Rxin0-
Rxin1+: J4.9 U12.45(Y1P) ; off-sheet Rxin1+
Rxin1-: J4.8 U12.46(Y1M) ; off-sheet Rxin1-
Rxin2+: J4.12 U12.41(Y2P) ; off-sheet Rxin2+
Rxin2-: J4.11 U12.42(Y2M) ; off-sheet Rxin2-
STM_LCD_ONOFF: R51.1 ; off-sheet STM_LCD_ONOFF
STM_LCD_PWM: R52.1 ; off-sheet STM_LCD_PWM
TP1_EN: R22.1 ; off-sheet TP1_EN
TP1_INT: U2.4(A2) ; off-sheet TP1_INT
TSC_IRQ: C40.1 U2.1(B2) U5.4(~{PENIRQ}) ; off-sheet TSC_IRQ
TSC_RST: U2.8(B1) U5.5(RESET) ; off-sheet TSC_RST
XEINT30/HDMI_CEC/ALV_DBG26: U2.5(A1) ; off-sheet XEINT30/HDMI_CEC/ALV_DBG26
XuCTSn2/I2C_3_SDA: U17.4(A2) ; off-sheet XuCTSn2/I2C_3_SDA
XuRTSn2/I2C_3_SCL: U17.5(A1) ; off-sheet XuRTSn2/I2C_3_SCL
NetC51_2: C51.2 J6.5 U5.9(AUX)
NetC52_2: C52.2 J6.4 U5.17(Y-)
NetC53_2: C53.2 J6.3 U5.16(X-)
NetC54_2: C54.2 J6.2 U5.14(Y+)
NetC55_2: C55.2 J6.1 U5.13(X+)
NetC148_1: C148.1 R50.1 U17.8(B1)
NetC149_1: C149.1 R49.1 U17.1(B2)
NetQ7_1: Q7.1(GATE) R8.2 R9.1
NetQ8_1: Q8.1(BASE) R7.1 R11.1
NetQ8_3: Q8.3(COLLECTOR) R9.2
NetR22_2: R22.2 U17.6(OE)
NetR48_2: R48.2 U2.6(OE)

Not connected (* = marked no-connect by the designer): J4 17 18 19 20; U5 8(NC) 19(NC); U12 37(Y3P) 38(Y3M)

### Notes on the sheet
- 整理完成
- LVDS Interface
- 1.8V  TO  3.3V
- 电平转换
- 电阻屏检测芯片
- LCD_R0
- LCD_R1
- LCD_R2
- LCD_R3
- LCD_R5
- LCD_G0
- LCD_G1
- LCD_R4
- LCD_G2
- LCD_G3
- LCD_G4
- LCD_B1
- LCD_G5
- LCD_B0
- LCD_B2
- LCD_B3
- LCD_B4
- LCD_B5
- 北京迅为电子有限公司  www.topeetboard.com

### Library data of the parts
C24 C25 C40 C79 C80 = C0603_0
C41-C44 C49 C50 = CAP: Published: 8-Jun-2000; LatestRevisionDate: 17-Jul-2002; LatestRevisionNote: Re-released for DXP Platform.; PackageReference: RAD-0.3; Publisher: Altium Limited
  C41 C42: Value: 10uF
  C43 C44 C49: Value: 0.1uF
  C50: Value: 22uF
C45-C48 C51-C55 = Cap Semi
C56 C59 C61 C62 = C1608_Dup2
C57 C60 C148 C149 = C0402_0
J4 = Header 20: Header, 20-Pin; LatestRevisionDate: 17-Jul-2002; LatestRevisionNote: Re-released for DXP Platform.; Publisher: Altium Limited
J5 = HEADER1X6
Q7 = MOSFET P
Q8 = L14P2/TO_1
R7-R11 R22 R49-R52 R86 R89 = R1005_0_Dup1
R48 = R0603_0
U2 U17 = TXS0102DCU_1
U3 = REG1117-3.3: 800mA and 1A Low Dropout Positive Regulator 2.85V, 3.3V, 5V, and Adjustable; Package Information: Latest Revision: revC; Published: 8-Jun-2000; Revision: 17-Jul-2002: Re-released for DXP Platform.; Datasheet: Latest Revision: Sep-1997; Package Reference: ZZ311; Publisher: Altium Limited
U5 = TSC2004IRTJ: Current Sensor
U12 = U-SN75LVDS83BDGG_3

## Sheet P09-USB_JTAG.SchDoc
size 513 x 386 mm
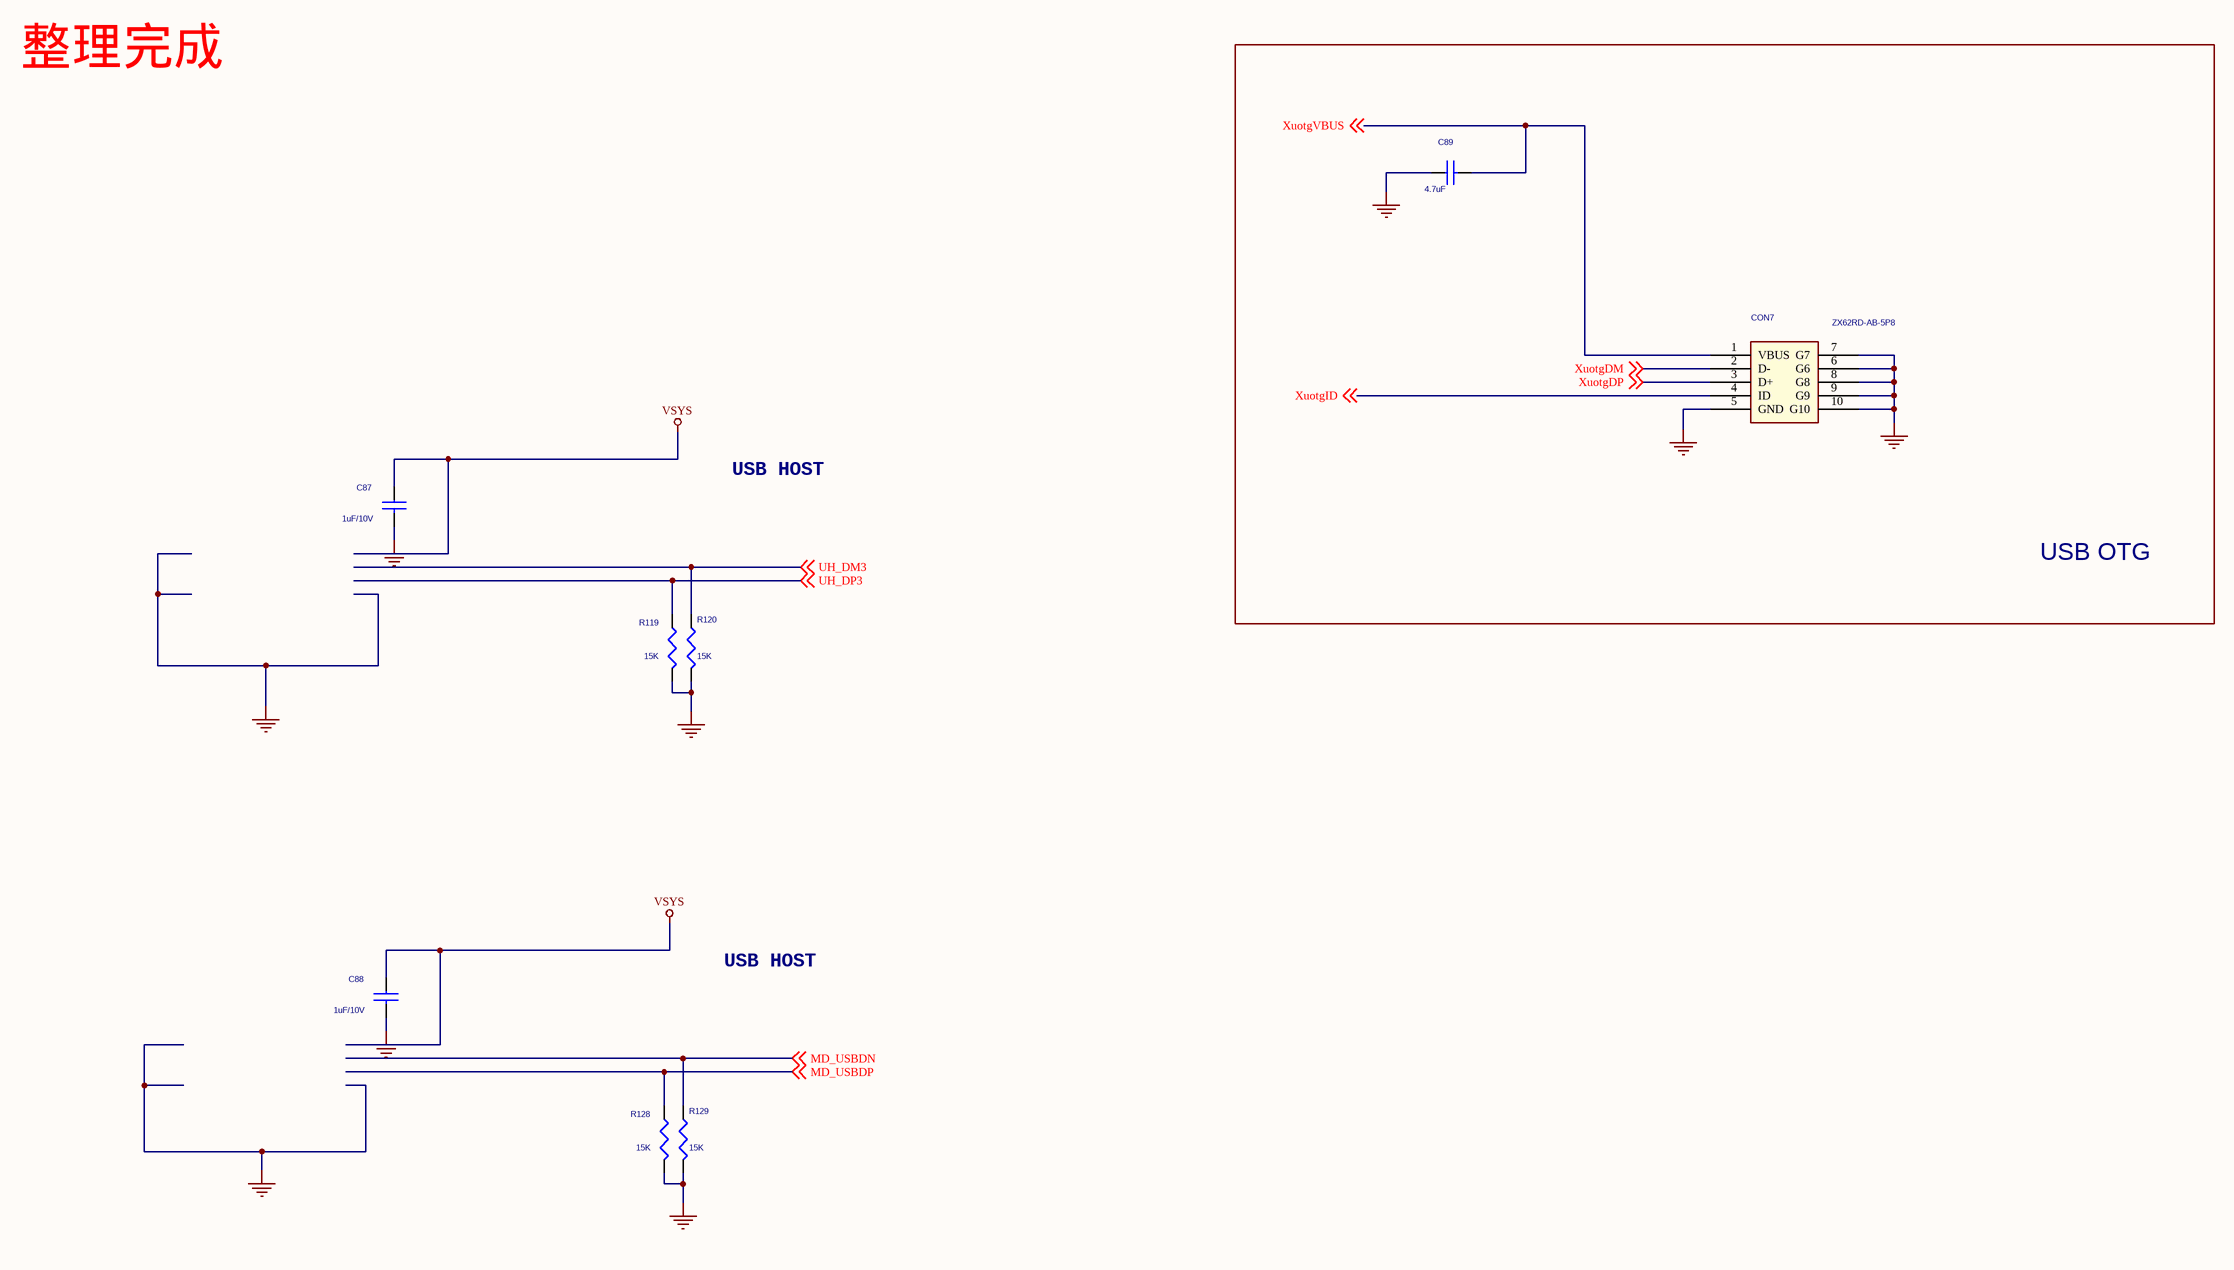
[diagram p13: P09-USB_JTAG.SchDoc]

### Parts
C87  1uF/10V  [C0603-S]
C88  1uF/10V  [C0603-S]
C89  4.7uF  [C0603-S]
CON7  ZX62RD-AB-5P8  [MICROUSB-B-H4]
R119  15K  [R0603-S]
R120  15K  [R0603-S]
R128  15K  [R0603-S]
R129  15K  [R0603-S]

### Blocks framed on the sheet
USB OTG: C89 CON7

### Nets
GND: C87.2 C88.2 C89.1 CON7.5(GND) CON7.6(G6) CON7.7(G7) CON7.8(G8) CON7.9(G9) CON7.10(G10) R119.1 R120.1 R128.1 R129.1
VSYS: C87.1 C88.1
MD_USBDN: R129.2 ; off-sheet MD_USBDN
MD_USBDP: R128.2 ; off-sheet MD_USBDP
UH_DM3: R120.2 ; off-sheet UH_DM3
UH_DP3: R119.2 ; off-sheet UH_DP3
XuotgDM: CON7.2(D-) ; off-sheet XuotgDM
XuotgDP: CON7.3(D+) ; off-sheet XuotgDP
XuotgID: CON7.4(ID) ; off-sheet XuotgID
XuotgVBUS: C89.2 CON7.1(VBUS) ; off-sheet XuotgVBUS

### Notes on the sheet
- 整理完成
- USB HOST

### Library data of the parts
C87 C88 = C0603_0
C89 = C1005
CON7 = ZX62RD-AB-5P8_3
R119 R120 R128 R129 = R1005_0

## Sheet P11-CAMERA AVIN.SchDoc
size 420 x 297 mm
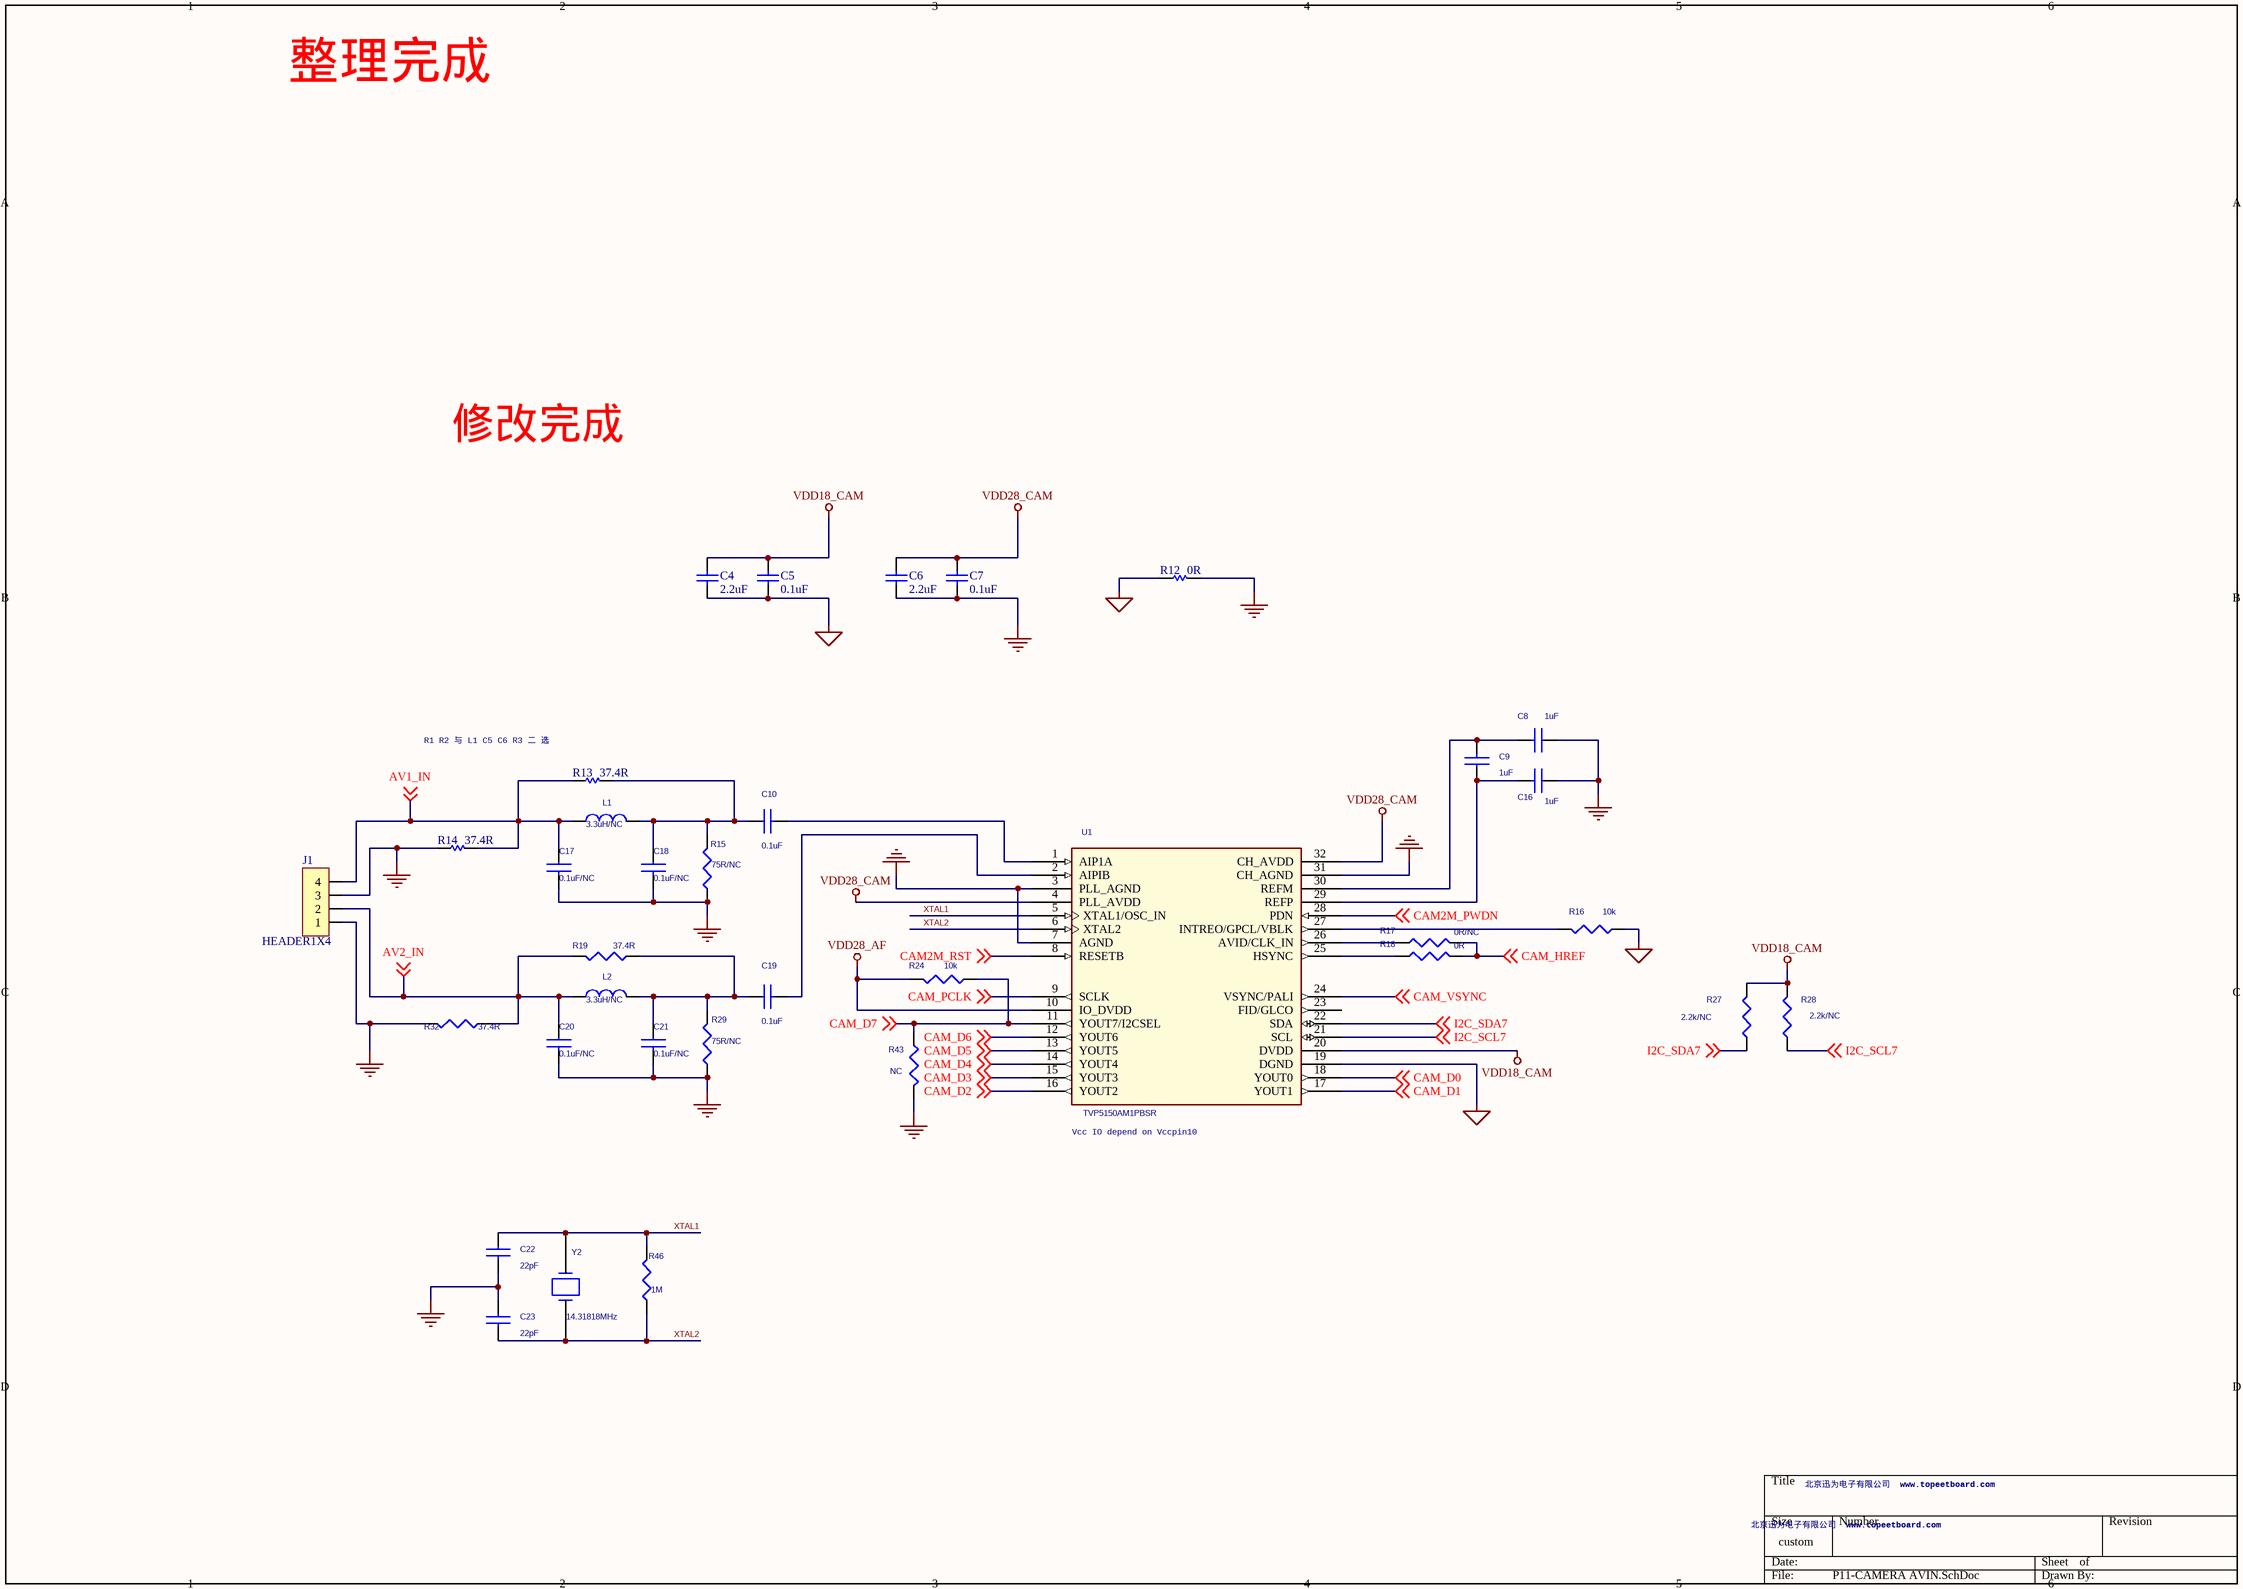
[diagram p14: P11-CAMERA AVIN.SchDoc]

### Parts
C4  2.2uF  [C0603-S]
C5  0.1uF  [C0603-S]
C6  2.2uF  [C0603-S]
C7  0.1uF  [C0603-S]
C8  1uF  [C0603-S]
C9  1uF  [C0603-S]
C10  0.1uF  [C0603-S]
C16  1uF  [C0603-S]
C17  0.1uF/NC  [C0603-S]
C18  0.1uF/NC  [C0603-S]
C19  0.1uF  [C0603-S]
C20  0.1uF/NC  [C0603-S]
C21  0.1uF/NC  [C0603-S]
C22  22pF  [C0603-s]
C23  22pF  [C0603-s]
J1  HEADER1X4  [HD1X4-2.00]
L1  3.3uH/NC  [L4X4-S]
L2  3.3uH/NC  [L4X4-S]
R12  0R  [R0603-S]
R13  37.4R  [R0603-S]
R14  37.4R  [R0603-S]
R15  75R/NC  [R0603-S]
R16  10k  [R0603-S]
R17  0R/NC  [R0603-S]
R18  0R  [R0603-S]
R19  37.4R  [R0603-S]
R24  10k  [R0603-S]
R27  2.2k/NC  [R0603-S]
R28  2.2k/NC  [R0603-S]
R29  75R/NC  [R0603-S]
R32  37.4R  [R0603-S]
R43  NC  [R0603-S]
R46  1M  [R0603-S]
U1  TVP5150AM1PBSR  [QFP7X7-32]
Y2  14.31818MHz  [CRYSTAL_D200]

### Nets
AGND: C4.1 C5.1 R12.1 R16.1 U1.19(DGND)
GND: C6.1 C7.1 C8.1 C16.1 C17.2 C18.2 C20.2 C21.2 C22.2 C23.1 J1.1 J1.3 R12.2 R14.1 R15.1 R29.1 R32.2 R43.2 U1.3(PLL_AGND) U1.7(AGND) U1.31(CH_AGND)
VDD18_CAM: C4.2 C5.2 R27.2 R28.2 U1.20(DVDD)
VDD28_AF: R24.2 U1.10(IO_DVDD)
VDD28_CAM: C6.2 C7.2 U1.4(PLL_AVDD) U1.32(CH_AVDD)
AV1_IN: C17.1 J1.4 L1.1 R13.1 R14.2 ; off-sheet AV1_IN
AV2_IN: C20.1 J1.2 L2.1 R19.2 R32.1 ; off-sheet AV2_IN
CAM2M_PWDN: U1.28(PDN) ; off-sheet CAM2M_PWDN
CAM2M_RST: U1.8(RESETB) ; off-sheet CAM2M_RST
CAM_D0: U1.18(YOUT0) ; off-sheet CAM_D0
CAM_D1: U1.17(YOUT1) ; off-sheet CAM_D1
CAM_D2: U1.16(YOUT2) ; off-sheet CAM_D2
CAM_D3: U1.15(YOUT3) ; off-sheet CAM_D3
CAM_D4: U1.14(YOUT4) ; off-sheet CAM_D4
CAM_D5: U1.13(YOUT5) ; off-sheet CAM_D5
CAM_D6: U1.12(YOUT6) ; off-sheet CAM_D6
CAM_D7: R24.1 R43.1 U1.11(YOUT7/I2CSEL) ; off-sheet CAM_D7
CAM_HREF: R17.2 R18.2 ; off-sheet CAM_HREF
CAM_PCLK: U1.9(SCLK) ; off-sheet CAM_PCLK
CAM_VSYNC: U1.24(VSYNC/PALI) ; off-sheet CAM_VSYNC
I2C_SCL7: R28.1 U1.21(SCL) ; off-sheet I2C_SCL7
I2C_SDA7: R27.1 U1.22(SDA) ; off-sheet I2C_SDA7
XTAL1: C22.1 R46.2 U1.5(XTAL1/OSC_IN) Y2.2
XTAL2: C23.2 R46.1 U1.6(XTAL2) Y2.1
NetC8_2: C8.2 C9.2 U1.30(REFM)
NetC9_1: C9.1 C16.2 U1.29(REFP)
NetC10_1: C10.1 C18.1 L1.2 R13.2 R15.2
NetC10_2: C10.2 U1.1(AIP1A)
NetC19_1: C19.1 C21.1 L2.2 R19.1 R29.2
NetC19_2: C19.2 U1.2(AIPIB)
NetR16_2: R16.2 U1.27(INTREO/GPCL/VBLK)
NetR17_1: R17.1 U1.26(AVID/CLK_IN)
NetR18_1: R18.1 U1.25(HSYNC)

Not connected (* = marked no-connect by the designer): U1 23(FID/GLCO)

### Notes on the sheet
- 整理完成
- 修改完成
- R1 R2 与 L1 C5 C6 R3 二 选
- (near U1) Vcc IO depend on Vccpin10
- 北京迅为电子有限公司  www.topeetboard.com

### Library data of the parts
C4-C7 = Cap Semi
C8-C10 C16-C21 = C0603_0
C22 C23 = C1005
L1 L2 = LQH32C_0
R12-R14 = Res
R15-R19 R24 R27-R29 R32 R43 R46 = R1005_0
U1 = TVP5151
Y2 = XM/SM

## Sheet P15-EXP_IO.SchDoc
size 817 x 513 mm
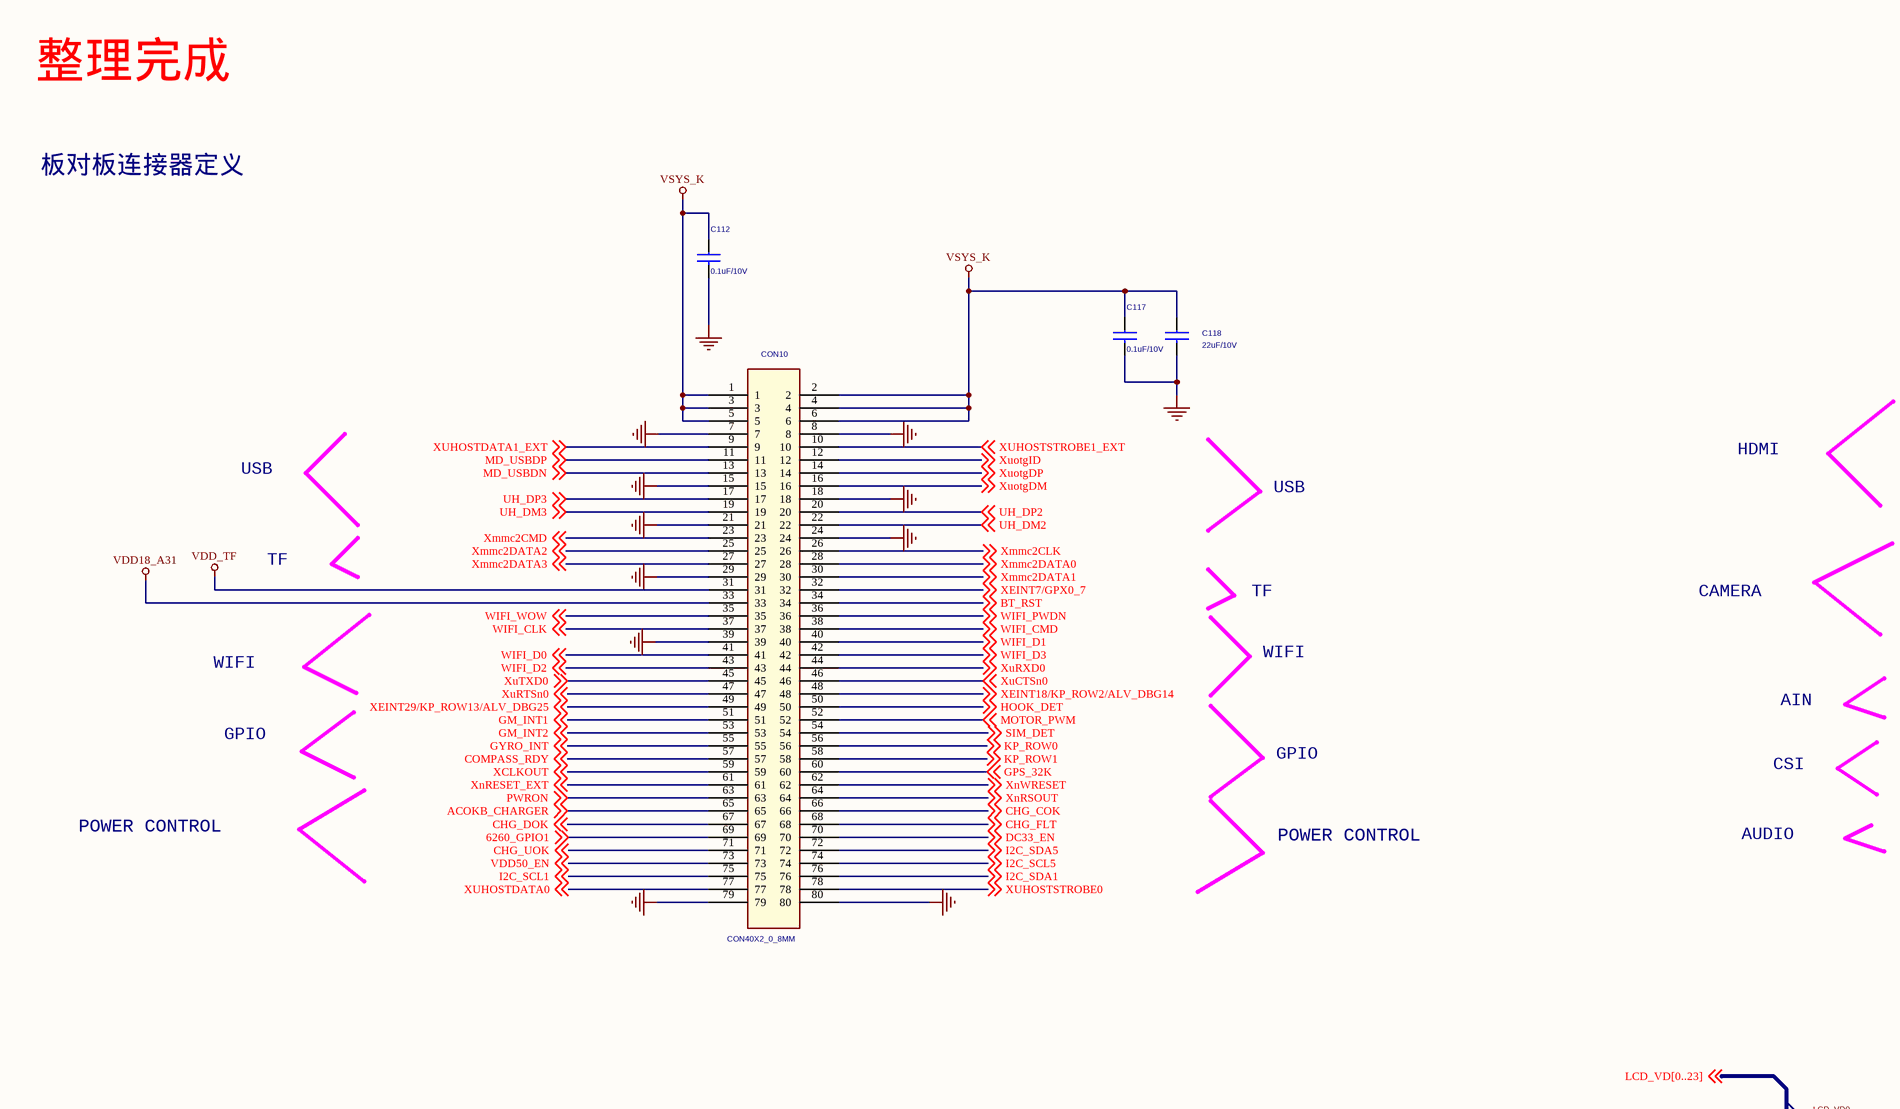
[diagram p15: P15-EXP_IO.SchDoc, top left]
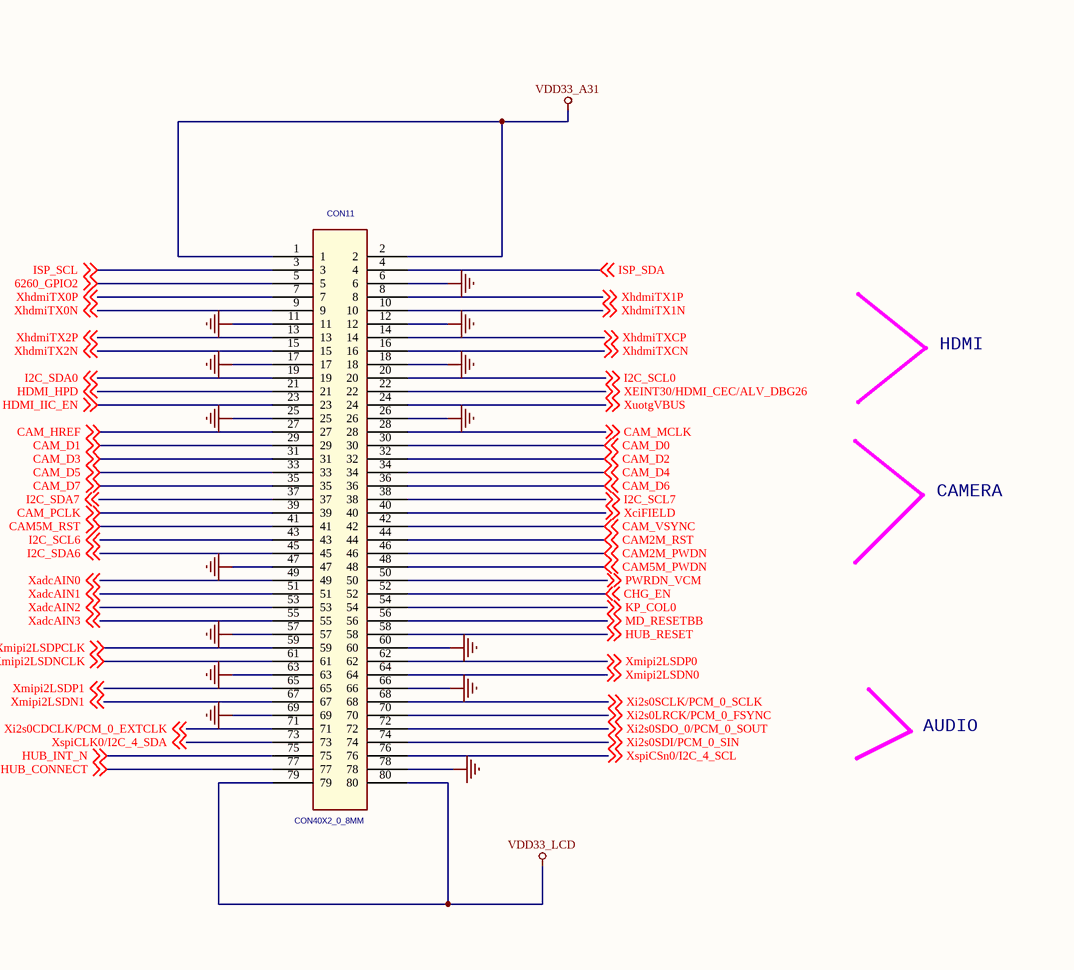
[diagram p16: P15-EXP_IO.SchDoc, top right]
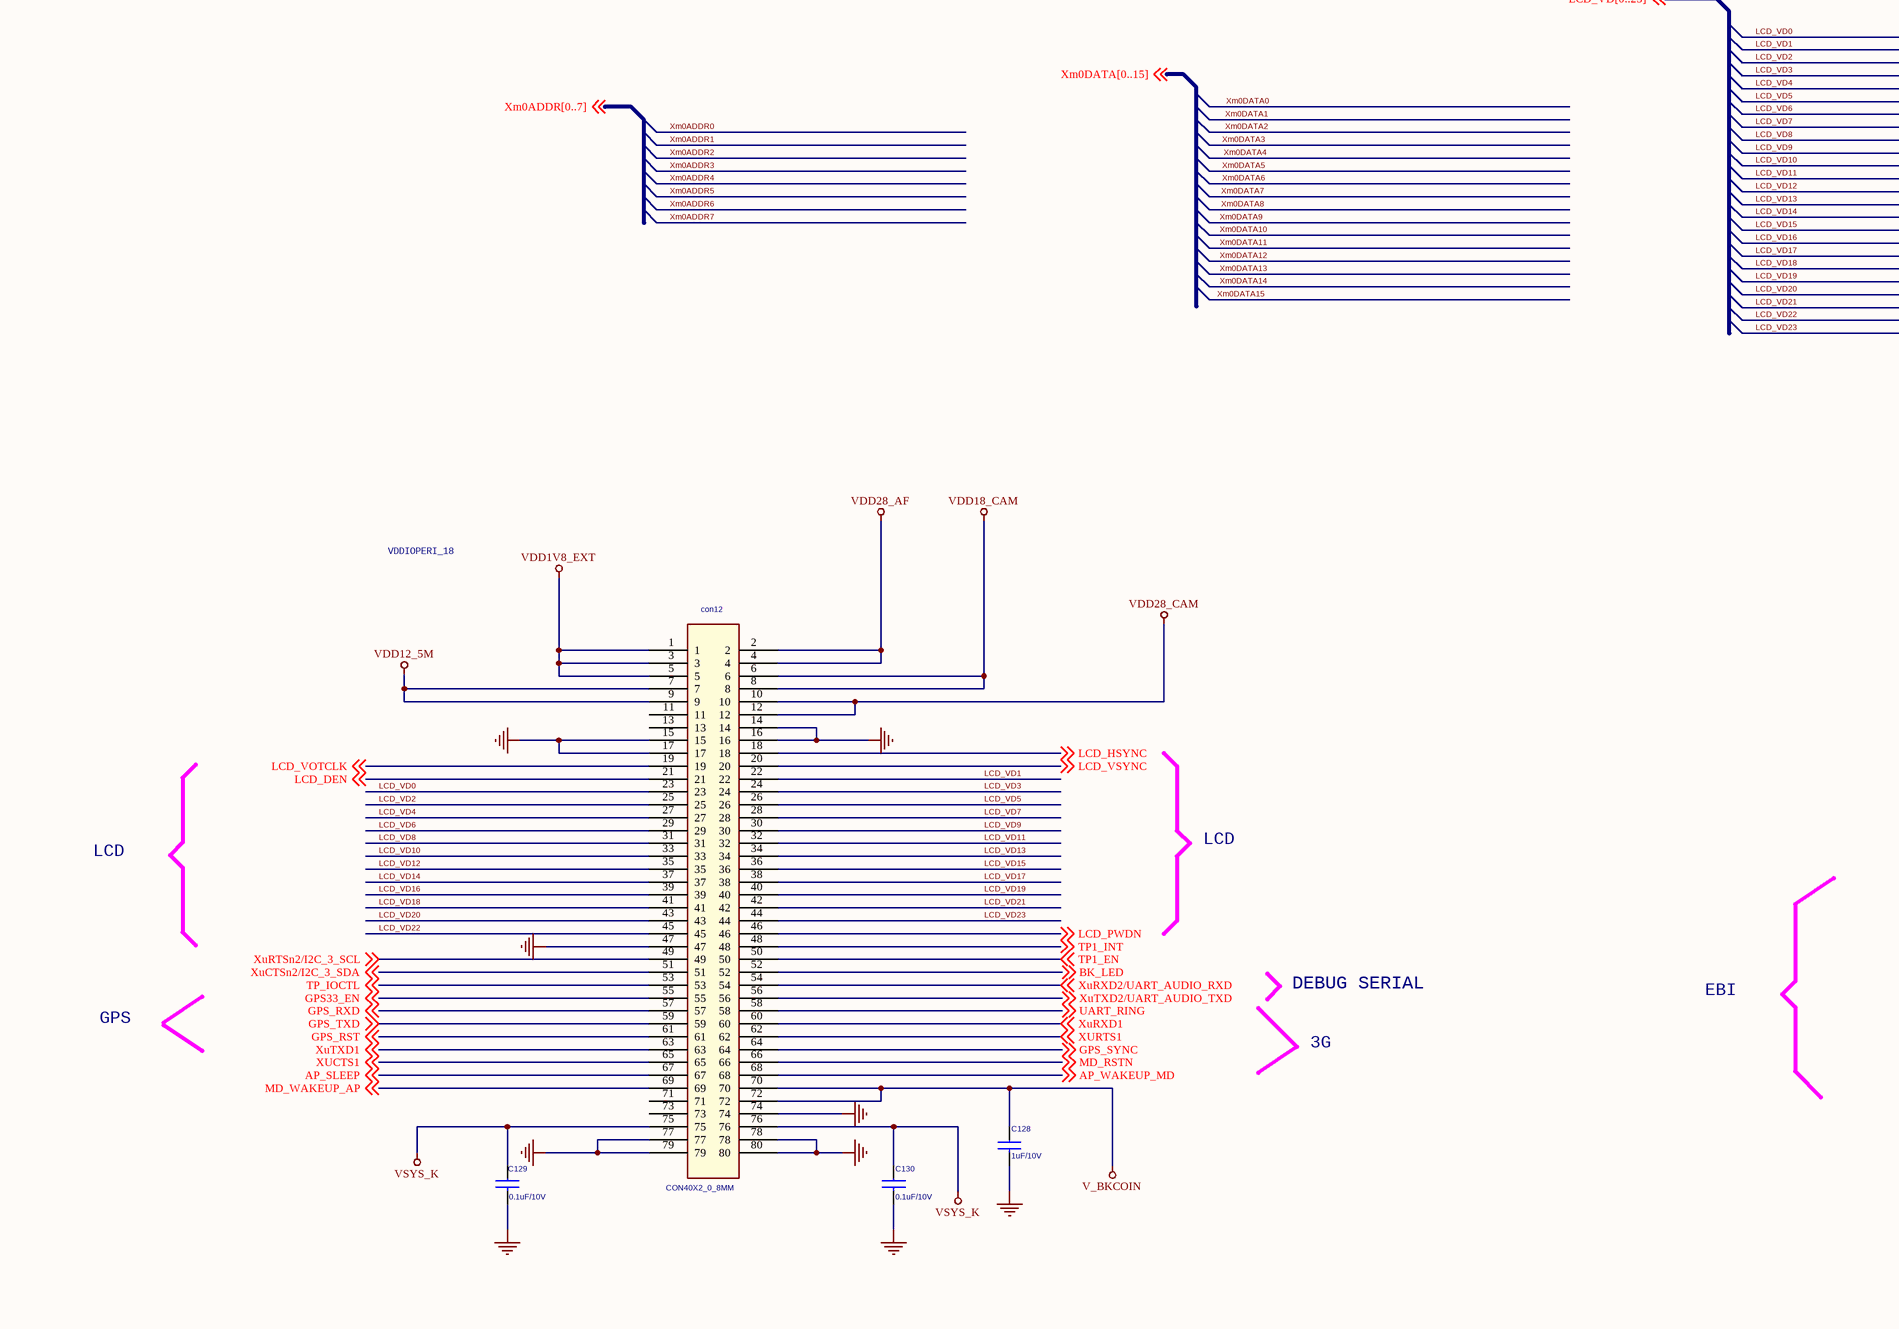
[diagram p17: P15-EXP_IO.SchDoc, bottom left]
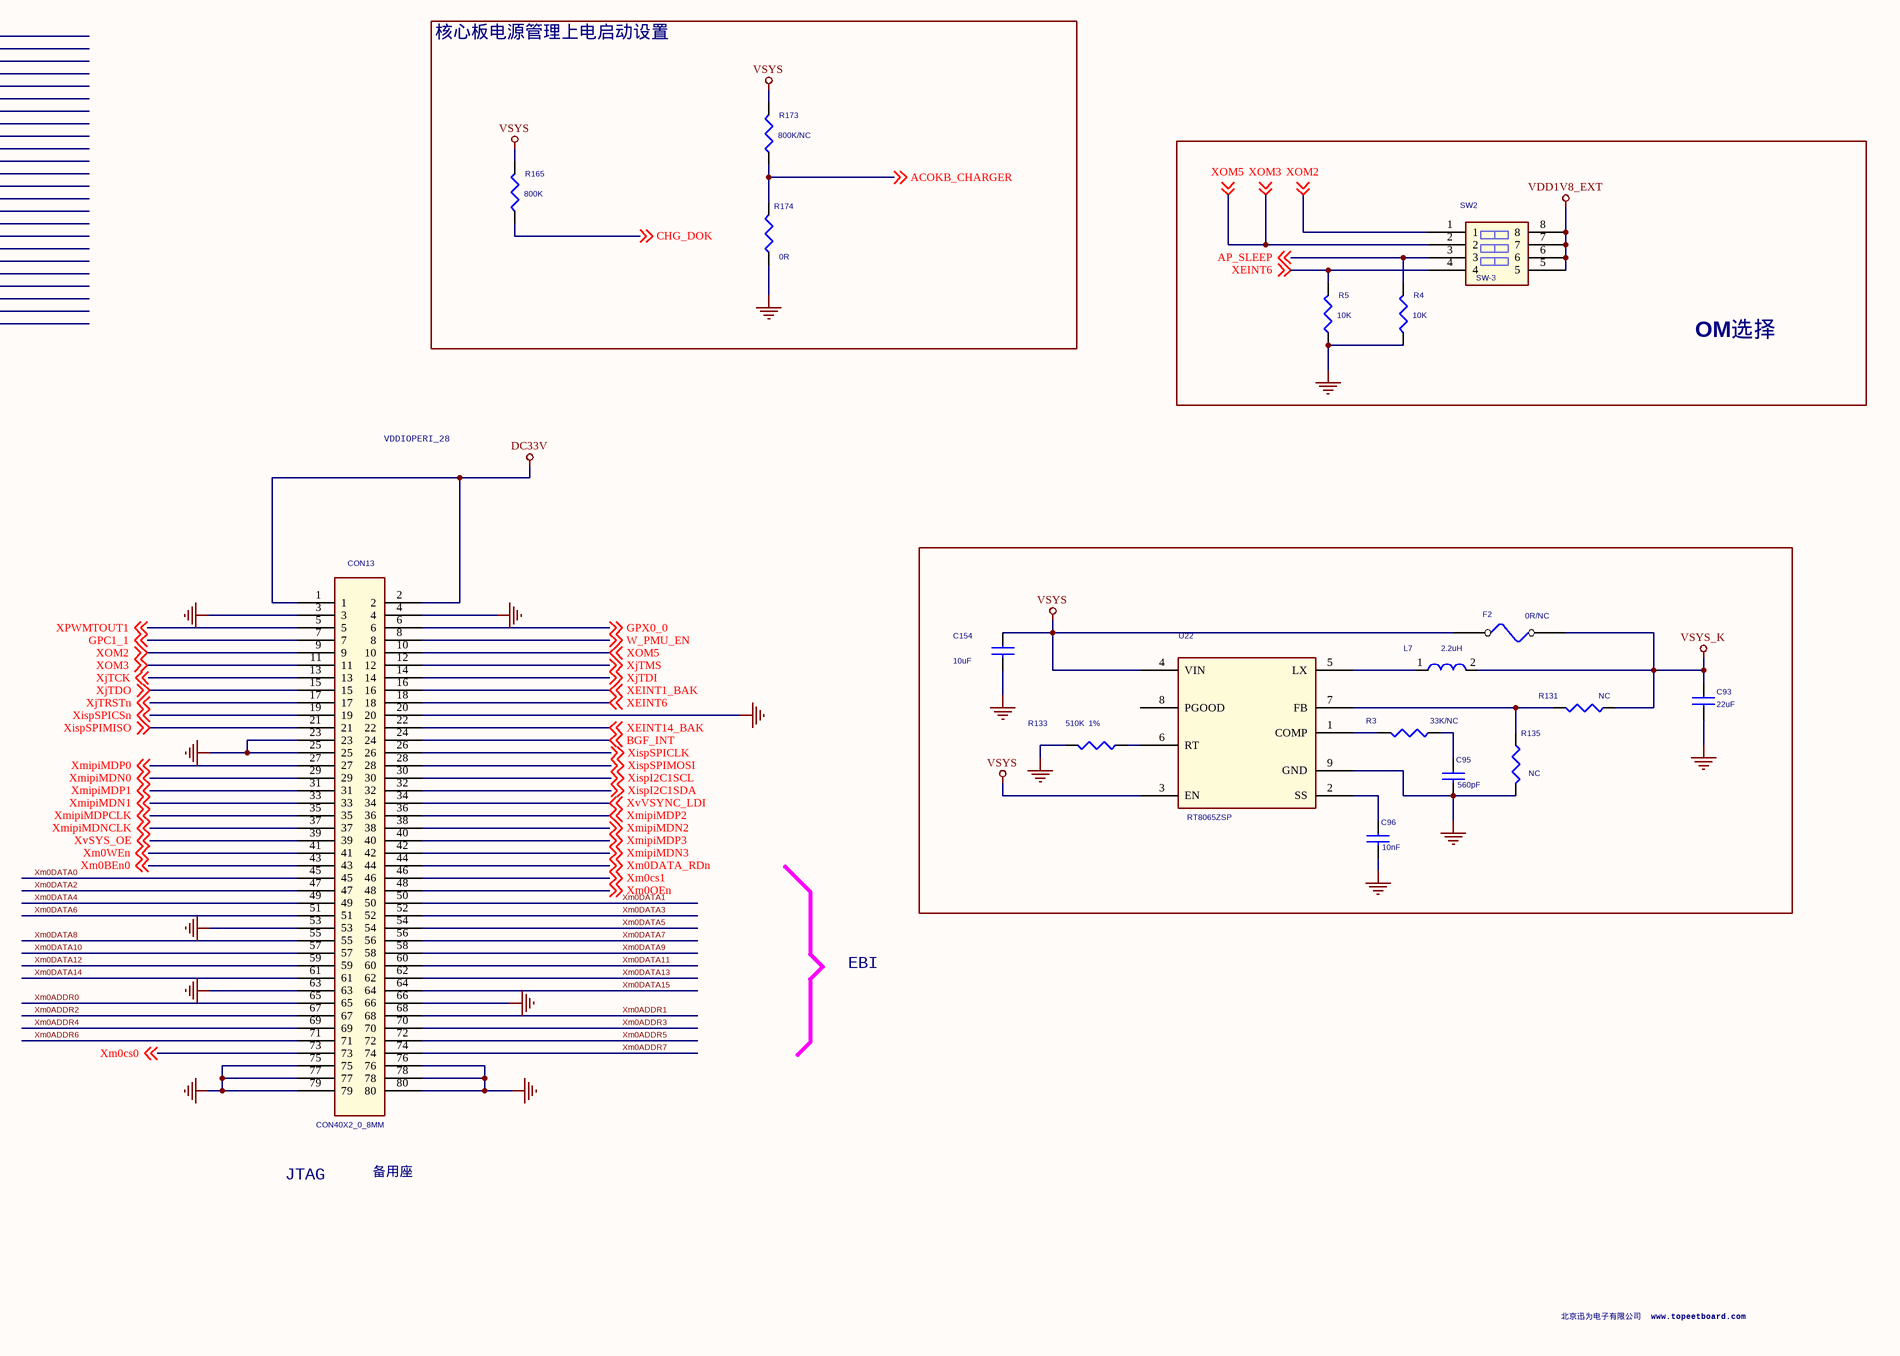
[diagram p18: P15-EXP_IO.SchDoc, bottom right]

### Parts
C93  22uF  [C0805-S]
C95  560pF  [C0603-S]
C96  10nF  [C0603-S]
C112  0.1uF/10V  [C0603-S]
C117  0.1uF/10V  [C0603-S]
C118  22uF/10V  [C1206-S]
C128  1uF/10V  [C0603-S]
C129  0.1uF/10V  [C0603-S]
C130  0.1uF/10V  [C0603-S]
C154  10uF  [C0603-S]
CON10  CON40X2_0_8MM  [CON2X40-0_5MM-BB]
CON11  CON40X2_0_8MM  [CON2X40-0_5MM-BB]
con12  CON40X2_0_8MM  [CON2X40-0_5MM-BB]
CON13  CON40X2_0_8MM  [CON2X40-0_5MM-BB]
F2  0R/NC  [F1206]
L7  2.2uH  [L3X3MM]
R3  33K/NC  [R0603-S]
R4  10K  [R0603-S]
R5  10K  [R0603-S]
R131  NC  [R0603-S]
R133  510K  1%  [R0603-S]
R135  NC  [R0603-S]
R165  800K  [R0603-S]
R173  800K/NC  [R0603-S]
R174  0R  [R0603-S]
SW2  SW-3  [bmkg4]
U22  RT8065ZSP  [soic8-lh]

### Blocks framed on the sheet
核心板电源管理上电启动设置: R165 R173 R174
OM选择: R4 R5 SW2

### Nets
DC33V: CON13.1 CON13.2
GND: C93.2 C95.2 C96.2 C112.2 C117.2 C118.2 C128.2 C129.2 C130.2 C154.2 CON10.7 CON10.8 CON10.15 CON10.18 CON10.21 CON10.24 CON10.29 CON10.39 CON10.79 CON10.80 CON11.6 CON11.11 CON11.12 CON11.17 CON11.18 CON11.25 CON11.26 CON11.47 CON11.57 CON11.60 CON11.63 CON11.66 CON11.69 CON11.78 con12.14 con12.15 con12.16 con12.17 con12.47 con12.74 con12.77 con12.78 con12.79 con12.80 CON13.3 CON13.4 CON13.20 CON13.23 CON13.25 CON13.53 CON13.63 CON13.66 CON13.75 CON13.76 CON13.77 CON13.78 CON13.79 CON13.80 R4.1 R5.1 R133.2 R135.2 R174.1 U22.9(GND)
V_BKCOIN: C128.1 con12.70 con12.72
VDD1V8_EXT: con12.1 con12.3 con12.5 SW2.5 SW2.6 SW2.7 SW2.8
VDD12_5M: con12.7 con12.9
VDD18_A31: CON10.33
VDD18_CAM: con12.6 con12.8
VDD28_AF: con12.2 con12.4
VDD28_CAM: con12.10 con12.12
VDD33_A31: CON11.1 CON11.2
VDD33_LCD: CON11.79 CON11.80
VDD_TF: CON10.31
VSYS: C154.1 F2.1 R165.2 R173.2 U22.3(EN) U22.4(VIN)
VSYS_K: C93.1 C112.1 C117.1 C118.1 C129.1 C130.1 CON10.1 CON10.2 CON10.3 CON10.4 CON10.5 CON10.6 con12.75 con12.76 F2.2 L7.2 R131.1
6260_GPIO1: CON10.69 ; off-sheet 6260_GPIO1
6260_GPIO2: CON11.5 ; off-sheet 6260_GPIO2
ACOKB_CHARGER: CON10.65 R173.1 R174.2 ; off-sheet ACOKB_CHARGER
AP_SLEEP: con12.67 R4.2 SW2.3 ; off-sheet AP_SLEEP
AP_WAKEUP_MD: con12.68 ; off-sheet AP_WAKEUP_MD
BGF_INT: CON13.24 ; off-sheet BGF_INT
BK_LED: con12.52 ; off-sheet BK_LED
BT_RST: CON10.34 ; off-sheet BT_RST
CAM2M_PWDN: CON11.46 ; off-sheet CAM2M_PWDN
CAM2M_RST: CON11.44 ; off-sheet CAM2M_RST
CAM5M_PWDN: CON11.48 ; off-sheet CAM5M_PWDN
CAM5M_RST: CON11.41 ; off-sheet CAM5M_RST
CAM_D0: CON11.30 ; off-sheet CAM_D0
CAM_D1: CON11.29 ; off-sheet CAM_D1
CAM_D2: CON11.32 ; off-sheet CAM_D2
CAM_D3: CON11.31 ; off-sheet CAM_D3
CAM_D4: CON11.34 ; off-sheet CAM_D4
CAM_D5: CON11.33 ; off-sheet CAM_D5
CAM_D6: CON11.36 ; off-sheet CAM_D6
CAM_D7: CON11.35 ; off-sheet CAM_D7
CAM_HREF: CON11.27 ; off-sheet CAM_HREF
CAM_MCLK: CON11.28 ; off-sheet CAM_MCLK
CAM_PCLK: CON11.39 ; off-sheet CAM_PCLK
CAM_VSYNC: CON11.42 ; off-sheet CAM_VSYNC
CHG_COK: CON10.66 ; off-sheet CHG_COK
CHG_DOK: CON10.67 R165.1 ; off-sheet CHG_DOK
CHG_EN: CON11.52 ; off-sheet CHG_EN
CHG_FLT: CON10.68 ; off-sheet CHG_FLT
CHG_UOK: CON10.71 ; off-sheet CHG_UOK
COMPASS_RDY: CON10.57 ; off-sheet COMPASS_RDY
DC33_EN: CON10.70 ; off-sheet DC33_EN
GM_INT1: CON10.51 ; off-sheet GM_INT1
GM_INT2: CON10.53 ; off-sheet GM_INT2
GPC1_1: CON13.7 ; off-sheet GPC1_1
GPS33_EN: con12.55 ; off-sheet GPS33_EN
GPS_32K: CON10.60 ; off-sheet GPS_32K
GPS_RST: con12.61 ; off-sheet GPS_RST
GPS_RXD: con12.57 ; off-sheet GPS_RXD
GPS_SYNC: con12.64 ; off-sheet GPS_SYNC
GPS_TXD: con12.59 ; off-sheet GPS_TXD
GPX0_0: CON13.6 ; off-sheet GPX0_0
GYRO_INT: CON10.55 ; off-sheet GYRO_INT
HDMI_HPD: CON11.21 ; off-sheet HDMI_HPD
HDMI_IIC_EN: CON11.23 ; off-sheet HDMI_IIC_EN
HOOK_DET: CON10.50 ; off-sheet HOOK_DET
HUB_CONNECT: CON11.77 ; off-sheet HUB_CONNECT
HUB_INT_N: CON11.75 ; off-sheet HUB_INT_N
HUB_RESET: CON11.58 ; off-sheet HUB_RESET
I2C_SCL0: CON11.20 ; off-sheet I2C_SCL0
I2C_SCL1: CON10.75 ; off-sheet I2C_SCL1
I2C_SCL5: CON10.74 ; off-sheet I2C_SCL5
I2C_SCL6: CON11.43 ; off-sheet I2C_SCL6
I2C_SCL7: CON11.38 ; off-sheet I2C_SCL7
I2C_SDA0: CON11.19 ; off-sheet I2C_SDA0
I2C_SDA1: CON10.76 ; off-sheet I2C_SDA1
I2C_SDA5: CON10.72 ; off-sheet I2C_SDA5
I2C_SDA6: CON11.45 ; off-sheet I2C_SDA6
I2C_SDA7: CON11.37 ; off-sheet I2C_SDA7
ISP_SCL: CON11.3 ; off-sheet ISP_SCL
ISP_SDA: CON11.4 ; off-sheet ISP_SDA
KP_COL0: CON11.54 ; off-sheet KP_COL0
KP_ROW0: CON10.56 ; off-sheet KP_ROW0
KP_ROW1: CON10.58 ; off-sheet KP_ROW1
LCD_DEN: con12.21 ; off-sheet LCD_DEN
LCD_HSYNC: con12.18 ; off-sheet LCD_HSYNC
LCD_PWDN: con12.46 ; off-sheet LCD_PWDN
LCD_VD0: con12.23
LCD_VD1: con12.22
LCD_VD2: con12.25
LCD_VD3: con12.24
LCD_VD4: con12.27
LCD_VD5: con12.26
LCD_VD6: con12.29
LCD_VD7: con12.28
LCD_VD8: con12.31
LCD_VD9: con12.30
LCD_VD10: con12.33
LCD_VD11: con12.32
LCD_VD12: con12.35
LCD_VD13: con12.34
LCD_VD14: con12.37
LCD_VD15: con12.36
LCD_VD16: con12.39
LCD_VD17: con12.38
LCD_VD18: con12.41
LCD_VD19: con12.40
LCD_VD20: con12.43
LCD_VD21: con12.42
LCD_VD22: con12.45
LCD_VD23: con12.44
LCD_VOTCLK: con12.19 ; off-sheet LCD_VOTCLK
LCD_VSYNC: con12.20 ; off-sheet LCD_VSYNC
MD_RESETBB: CON11.56 ; off-sheet MD_RESETBB
MD_RSTN: con12.66 ; off-sheet MD_RSTN
MD_USBDN: CON10.13 ; off-sheet MD_USBDN
MD_USBDP: CON10.11 ; off-sheet MD_USBDP
MD_WAKEUP_AP: con12.69 ; off-sheet MD_WAKEUP_AP
MOTOR_PWM: CON10.52 ; off-sheet MOTOR_PWM
PWRDN_VCM: CON11.50 ; off-sheet PWRDN_VCM
PWRON: CON10.63 ; off-sheet PWRON
SIM_DET: CON10.54 ; off-sheet SIM_DET
TP1_EN: con12.50 ; off-sheet TP1_EN
TP1_INT: con12.48 ; off-sheet TP1_INT
TP_IOCTL: con12.53 ; off-sheet TP_IOCTL
UART_RING: con12.58 ; off-sheet UART_RING
UH_DM2: CON10.22 ; off-sheet UH_DM2
UH_DM3: CON10.19 ; off-sheet UH_DM3
UH_DP2: CON10.20 ; off-sheet UH_DP2
UH_DP3: CON10.17 ; off-sheet UH_DP3
VDD50_EN: CON10.73 ; off-sheet VDD50_EN
W_PMU_EN: CON13.8 ; off-sheet W_PMU_EN
WIFI_CLK: CON10.37 ; off-sheet WIFI_CLK
WIFI_CMD: CON10.38 ; off-sheet WIFI_CMD
WIFI_D0: CON10.41 ; off-sheet WIFI_D0
WIFI_D1: CON10.40 ; off-sheet WIFI_D1
WIFI_D2: CON10.43 ; off-sheet WIFI_D2
WIFI_D3: CON10.42 ; off-sheet WIFI_D3
WIFI_PWDN: CON10.36 ; off-sheet WIFI_PWDN
WIFI_WOW: CON10.35 ; off-sheet WIFI_WOW
XadcAIN0: CON11.49 ; off-sheet XadcAIN0
XadcAIN1: CON11.51 ; off-sheet XadcAIN1
XadcAIN2: CON11.53 ; off-sheet XadcAIN2
XadcAIN3: CON11.55 ; off-sheet XadcAIN3
XciFIELD: CON11.40 ; off-sheet XciFIELD
XCLKOUT: CON10.59 ; off-sheet XCLKOUT
XEINT1_BAK: CON13.16 ; off-sheet XEINT1_BAK
XEINT6: CON13.18 R5.2 SW2.4 ; off-sheet XEINT6
XEINT7/GPX0_7: CON10.32 ; off-sheet XEINT7/GPX0_7
XEINT14_BAK: CON13.22 ; off-sheet XEINT14_BAK
XEINT18/KP_ROW2/ALV_DBG14: CON10.48 ; off-sheet XEINT18/KP_ROW2/ALV_DBG14
XEINT29/KP_ROW13/ALV_DBG25: CON10.49 ; off-sheet XEINT29/KP_ROW13/ALV_DBG25
XEINT30/HDMI_CEC/ALV_DBG26: CON11.22 ; off-sheet XEINT30/HDMI_CEC/ALV_DBG26
XhdmiTX0N: CON11.9 ; off-sheet XhdmiTX0N
XhdmiTX0P: CON11.7 ; off-sheet XhdmiTX0P
XhdmiTX1N: CON11.10 ; off-sheet XhdmiTX1N
XhdmiTX1P: CON11.8 ; off-sheet XhdmiTX1P
XhdmiTX2N: CON11.15 ; off-sheet XhdmiTX2N
XhdmiTX2P: CON11.13 ; off-sheet XhdmiTX2P
XhdmiTXCN: CON11.16 ; off-sheet XhdmiTXCN
XhdmiTXCP: CON11.14 ; off-sheet XhdmiTXCP
Xi2s0CDCLK/PCM_0_EXTCLK: CON11.71 ; off-sheet Xi2s0CDCLK/PCM_0_EXTCLK
Xi2s0LRCK/PCM_0_FSYNC: CON11.70 ; off-sheet Xi2s0LRCK/PCM_0_FSYNC
Xi2s0SCLK/PCM_0_SCLK: CON11.68 ; off-sheet Xi2s0SCLK/PCM_0_SCLK
Xi2s0SDI/PCM_0_SIN: CON11.74 ; off-sheet Xi2s0SDI/PCM_0_SIN
Xi2s0SDO_0/PCM_0_SOUT: CON11.72 ; off-sheet Xi2s0SDO_0/PCM_0_SOUT
XispI2C1SCL: CON13.30 ; off-sheet XispI2C1SCL
XispI2C1SDA: CON13.32 ; off-sheet XispI2C1SDA
XispSPICLK: CON13.26 ; off-sheet XispSPICLK
XispSPICSn: CON13.19 ; off-sheet XispSPICSn
XispSPIMISO: CON13.21 ; off-sheet XispSPIMISO
XispSPIMOSI: CON13.28 ; off-sheet XispSPIMOSI
XjTCK: CON13.13 ; off-sheet XjTCK
XjTDI: CON13.14 ; off-sheet XjTDI
XjTDO: CON13.15 ; off-sheet XjTDO
XjTMS: CON13.12 ; off-sheet XjTMS
XjTRSTn: CON13.17 ; off-sheet XjTRSTn
Xm0ADDR0: CON13.65
Xm0ADDR1: CON13.68
Xm0ADDR2: CON13.67
Xm0ADDR3: CON13.70
Xm0ADDR4: CON13.69
Xm0ADDR5: CON13.72
Xm0ADDR6: CON13.71
Xm0ADDR7: CON13.74
Xm0BEn0: CON13.43 ; off-sheet Xm0BEn0
Xm0cs0: CON13.73 ; off-sheet Xm0cs0
Xm0cs1: CON13.46 ; off-sheet Xm0cs1
Xm0DATA0: CON13.45
Xm0DATA1: CON13.50
Xm0DATA2: CON13.47
Xm0DATA3: CON13.52
Xm0DATA4: CON13.49
Xm0DATA5: CON13.54
Xm0DATA6: CON13.51
Xm0DATA7: CON13.56
Xm0DATA8: CON13.55
Xm0DATA9: CON13.58
Xm0DATA10: CON13.57
Xm0DATA11: CON13.60
Xm0DATA12: CON13.59
Xm0DATA13: CON13.62
Xm0DATA14: CON13.61
Xm0DATA15: CON13.64
Xm0DATA_RDn: CON13.44 ; off-sheet Xm0DATA_RDn
Xm0OEn: CON13.48 ; off-sheet Xm0OEn
Xm0WEn: CON13.41 ; off-sheet Xm0WEn
Xmipi2LSDN0: CON11.64 ; off-sheet Xmipi2LSDN0
Xmipi2LSDN1: CON11.67 ; off-sheet Xmipi2LSDN1
Xmipi2LSDNCLK: CON11.61 ; off-sheet Xmipi2LSDNCLK
Xmipi2LSDP0: CON11.62 ; off-sheet Xmipi2LSDP0
Xmipi2LSDP1: CON11.65 ; off-sheet Xmipi2LSDP1
Xmipi2LSDPCLK: CON11.59 ; off-sheet Xmipi2LSDPCLK
XmipiMDN0: CON13.29 ; off-sheet XmipiMDN0
XmipiMDN1: CON13.33 ; off-sheet XmipiMDN1
XmipiMDN2: CON13.38 ; off-sheet XmipiMDN2
XmipiMDN3: CON13.42 ; off-sheet XmipiMDN3
XmipiMDNCLK: CON13.37 ; off-sheet XmipiMDNCLK
XmipiMDP0: CON13.27 ; off-sheet XmipiMDP0
XmipiMDP1: CON13.31 ; off-sheet XmipiMDP1
XmipiMDP2: CON13.36 ; off-sheet XmipiMDP2
XmipiMDP3: CON13.40 ; off-sheet XmipiMDP3
XmipiMDPCLK: CON13.35 ; off-sheet XmipiMDPCLK
Xmmc2CLK: CON10.26 ; off-sheet Xmmc2CLK
Xmmc2CMD: CON10.23 ; off-sheet Xmmc2CMD
Xmmc2DATA0: CON10.28 ; off-sheet Xmmc2DATA0
Xmmc2DATA1: CON10.30 ; off-sheet Xmmc2DATA1
Xmmc2DATA2: CON10.25 ; off-sheet Xmmc2DATA2
Xmmc2DATA3: CON10.27 ; off-sheet Xmmc2DATA3
XnRESET_EXT: CON10.61 ; off-sheet XnRESET_EXT
XnRSOUT: CON10.64 ; off-sheet XnRSOUT
XnWRESET: CON10.62 ; off-sheet XnWRESET
XOM2: CON13.9 SW2.1 ; off-sheet XOM2
XOM3: CON13.10 CON13.11 SW2.2 ; off-sheet XOM5, off-sheet XOM3  [also labelled XOM5]
XPWMTOUT1: CON13.5 ; off-sheet XPWMTOUT1
XspiCLK0/I2C_4_SDA: CON11.73 ; off-sheet XspiCLK0/I2C_4_SDA
XspiCSn0/I2C_4_SCL: CON11.76 ; off-sheet XspiCSn0/I2C_4_SCL
XUCTS1: con12.65 ; off-sheet XUCTS1
XuCTSn0: CON10.46 ; off-sheet XuCTSn0
XuCTSn2/I2C_3_SDA: con12.51 ; off-sheet XuCTSn2/I2C_3_SDA
XUHOSTDATA0: CON10.77 ; off-sheet XUHOSTDATA0
XUHOSTDATA1_EXT: CON10.9 ; off-sheet XUHOSTDATA1_EXT
XUHOSTSTROBE0: CON10.78 ; off-sheet XUHOSTSTROBE0
XUHOSTSTROBE1_EXT: CON10.10 ; off-sheet XUHOSTSTROBE1_EXT
XuotgDM: CON10.16 ; off-sheet XuotgDM
XuotgDP: CON10.14 ; off-sheet XuotgDP
XuotgID: CON10.12 ; off-sheet XuotgID
XuotgVBUS: CON11.24 ; off-sheet XuotgVBUS
XURTS1: con12.62 ; off-sheet XURTS1
XuRTSn0: CON10.47 ; off-sheet XuRTSn0
XuRTSn2/I2C_3_SCL: con12.49 ; off-sheet XuRTSn2/I2C_3_SCL
XuRXD0: CON10.44 ; off-sheet XuRXD0
XuRXD1: con12.60 ; off-sheet XuRXD1
XuRXD2/UART_AUDIO_RXD: con12.54 ; off-sheet XuRXD2/UART_AUDIO_RXD
XuTXD0: CON10.45 ; off-sheet XuTXD0
XuTXD1: con12.63 ; off-sheet XuTXD1
XuTXD2/UART_AUDIO_TXD: con12.56 ; off-sheet XuTXD2/UART_AUDIO_TXD
XvSYS_OE: CON13.39 ; off-sheet XvSYS_OE
XvVSYNC_LDI: CON13.34 ; off-sheet XvVSYNC_LDI
NetC95_1: C95.1 R3.1
NetC96_1: C96.1 U22.2(SS)
NetL7_1: L7.1 U22.5(LX)
NetR3_2: R3.2 U22.1(COMP)
NetR131_2: R131.2 R135.1 U22.7(FB)
NetR133_1: R133.1 U22.6(RT)

Not connected (* = marked no-connect by the designer): con12 11 13 71 73; U22 8(PGOOD)

### Notes on the sheet
- 整理完成
- 板对板连接器定义
- USB
- HDMI
- TF
- CAMERA
- WIFI
- AIN
- GPIO
- CSI
- POWER CONTROL
- AUDIO
- VDDIOPERI_28
- VDDIOPERI_18
- LCD
- GPS
- DEBUG SERIAL
- 3G
- EBI
- JTAG
- 备用座
- 北京迅为电子有限公司  www.topeetboard.com

### Library data of the parts
C93 = C1005
C95 = CAP NP_3: CER CHIP 1U 10% X5R 0402 10V  L/F; MANUFACTURER_PN: LDK105BJ105KV-F; MANUFACTURER_NAME: TAIYOYUDEN; PART_TYPE: P06-Cer CAP; USI_PN: 06-210594-01; GREEN_STATUS: Green Part; TW_MM_PLANT: 1130;1120;1110;1140; SH_MM_PLANT: 1510,1511,1520,1521; SZ_MM_PLANT: 1240,1210,1260; SH_LEAD_TIME: 56; SH_UNITCOST: 0.034128632; SZ_UNITCOST: 0.024593249; SH_INVENTORY: 10000.000; SZ_INVENTORY: 0; REMARK: Update on 20090523; INVENTORY: 160698.000; UNITCOST: 0.006868; ROOM: BACKUP_BATT; BOM_GRP: PWR_BACKUP-BATT; USI_Description: CER CHIP 1U 10% X5R 0402 10V  L/F; SZ_LEAD_TIME: 56; SH_LASTBUY_DATE: 2009-03-31; SZ_LASTBUY_DATE: 2009-04-01; LEAD_TIME: 56; LASTBUY_DATE: 2007-07-01; LIFECYCLE: AMPL2; DATA_SHEET: http://pdmas.usi.com.tw/pdm?url=http://pdmap.usi.com.tw/Agile/PLMServlet?action=OpenEmailObject&classid=10000&objid=140990334; FOOTPRINT_LINK: smd_0402_cap.dra; PART_NUMBER: 06-210594-01; Component Type: 1UF; CHE: 0
C96 C154 = CAP NP_3: CER CHIP 1U 10% X5R 0402 10V  L/F; PART_NUMBER: 06-210594-01; PART_TYPE: P06-Cer CAP; MANUFACTURER_NAME: TAIYOYUDEN; MANUFACTURER_PN: LDK105BJ105KV-F; BOM_GRP: PWR_BACKUP-BATT; ROOM: BACKUP_BATT; CHE: 0; UNITCOST: 0.006868; INVENTORY: 160698.000; LEAD_TIME: 56; REMARK: Update on 20090523; SH_INVENTORY: 10000.000; SZ_UNITCOST: 0.024593249; SH_UNITCOST: 0.034128632; SZ_MM_PLANT: 1240,1210,1260; SH_MM_PLANT: 1510,1511,1520,1521; TW_MM_PLANT: 1130;1120;1110;1140; GREEN_STATUS: Green Part; Component Type: 1UF; FOOTPRINT_LINK: smd_0402_cap.dra; DATA_SHEET: http://pdmas.usi.com.tw/pdm?url=http://pdmap.usi.com.tw/Agile/PLMServlet?action=OpenEmailObject&classid=10000&objid=140990334; LIFECYCLE: AMPL2; LASTBUY_DATE: 2007-07-01; SZ_INVENTORY: 0; SZ_LASTBUY_DATE: 2009-04-01; SH_LASTBUY_DATE: 2009-03-31; SZ_LEAD_TIME: 56; SH_LEAD_TIME: 56; USI_Description: CER CHIP 1U 10% X5R 0402 10V  L/F; USI_PN: 06-210594-01
C112 C117 C129 C130 = C0402_0
C118 = C1206_0
C128 = C0603_0
F2 = FUSE
L7 = LQH32C_0
R3 R131 R133 R135 = R1005_0
R4 R5 R165 R173 R174 = R1005_0_Dup1
SW2 = SW-3_1
U22 = RT8065_3

## Sheet P16-Connector.SchDoc
size A4
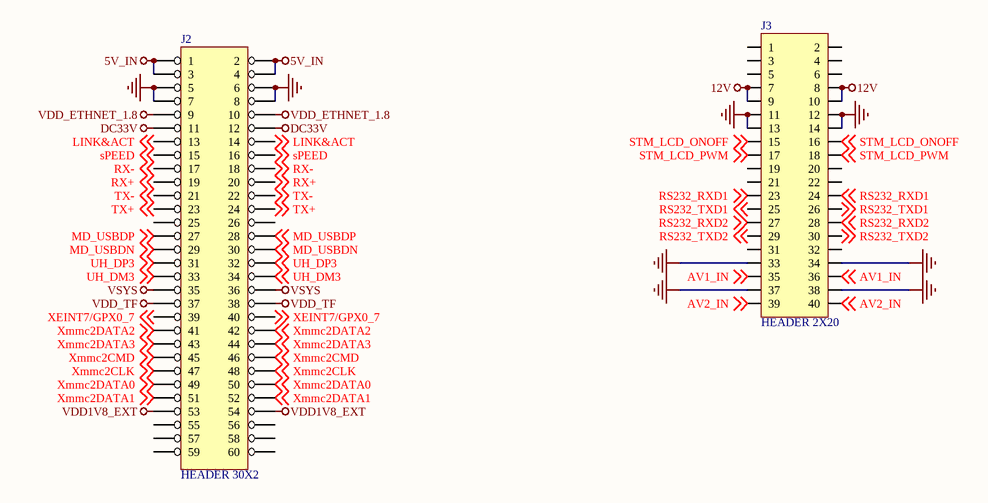
[diagram p19: P16-Connector.SchDoc]

### Parts
J2  HEADER 30X2  [HD2X30-2.00]
J3  HEADER 2X20  [HD2X20-2.00]

### Nets
5V_IN: J2.1 J2.2 J2.3 J2.4
12V: J3.7 J3.8 J3.9 J3.10
DC33V: J2.11 J2.12
GND: J2.5 J2.6 J2.7 J2.8 J3.11 J3.12 J3.13 J3.14 J3.33 J3.34 J3.37 J3.38
VDD1V8_EXT: J2.53 J2.54
VDD_ETHNET_1.8: J2.9 J2.10
VDD_TF: J2.37 J2.38
VSYS: J2.35 J2.36
AV1_IN: J3.35 J3.36 ; off-sheet AV1_IN
AV2_IN: J3.39 J3.40 ; off-sheet AV2_IN
LINK&ACT: J2.13 J2.14 ; off-sheet LINK&ACT
MD_USBDN: J2.29 J2.30 ; off-sheet MD_USBDN
MD_USBDP: J2.27 J2.28 ; off-sheet MD_USBDP
RS232_RXD1: J3.23 J3.24 ; off-sheet RS232_RXD1
RS232_RXD2: J3.27 J3.28 ; off-sheet RS232_RXD2
RS232_TXD1: J3.25 J3.26 ; off-sheet RS232_TXD1
RS232_TXD2: J3.29 J3.30 ; off-sheet RS232_TXD2
RX+: J2.19 J2.20 ; off-sheet RX+
RX-: J2.17 J2.18 ; off-sheet RX-
sPEED: J2.15 J2.16 ; off-sheet sPEED
STM_LCD_ONOFF: J3.15 J3.16 ; off-sheet STM_LCD_ONOFF
STM_LCD_PWM: J3.17 J3.18 ; off-sheet STM_LCD_PWM
TX+: J2.23 J2.24 ; off-sheet TX+
TX-: J2.21 J2.22 ; off-sheet TX-
UH_DM3: J2.33 J2.34 ; off-sheet UH_DM3
UH_DP3: J2.31 J2.32 ; off-sheet UH_DP3
XEINT7/GPX0_7: J2.39 J2.40 ; off-sheet XEINT7/GPX0_7
Xmmc2CLK: J2.47 J2.48 ; off-sheet Xmmc2CLK
Xmmc2CMD: J2.45 J2.46 ; off-sheet Xmmc2CMD
Xmmc2DATA0: J2.49 J2.50 ; off-sheet Xmmc2DATA0
Xmmc2DATA1: J2.51 J2.52 ; off-sheet Xmmc2DATA1
Xmmc2DATA2: J2.41 J2.42 ; off-sheet Xmmc2DATA2
Xmmc2DATA3: J2.43 J2.44 ; off-sheet Xmmc2DATA3

Not connected (* = marked no-connect by the designer): J2 25 26 55 56 57 58 59 60; J3 1 2 3 4 5 6 19 20 21 22 31 32

## Nets that join several sheets
5V_IN: P02-DC_JACK (F1.1), P16-Connector (J2.1 J2.2 J2.3 J2.4)
12V: P07-LCD (C49.2 C50.2 J5.5 J5.6), P16-Connector (J3.7 J3.8 J3.9 J3.10)
DC33V: P02-DC_JACK (D1.1), P03-UARTs_KEY (C11.1 C12.1 U4.16), P04-NET (15 pins), P07-LCD (7 pins), P15-EXP_IO (CON13.1 CON13.2), P16-Connector (J2.11 J2.12)
GND: P02-DC_JACK (5 pins), P03-UARTs_KEY (5 pins), P04-NET (42 pins), P07-LCD (64 pins), P09-USB_JTAG (13 pins), P11-CAMERA AVIN (21 pins), P15-EXP_IO (64 pins), P16-Connector (12 pins)
V_BKCOIN: P02-DC_JACK (R23.1), P15-EXP_IO (C128.1 con12.70 con12.72)
VDD1V8_EXT: P04-NET (C58.1 U9.1 U9.31 U9.42), P07-LCD (10 pins), P15-EXP_IO (7 pins), P16-Connector (J2.53 J2.54)
VDD18_CAM: P07-LCD (C47.2 C48.2 U5.11 U5.12), P11-CAMERA AVIN (5 pins), P15-EXP_IO (con12.6 con12.8)
VDD28_AF: P11-CAMERA AVIN (R24.2 U1.10), P15-EXP_IO (con12.2 con12.4)
VDD28_CAM: P11-CAMERA AVIN (C6.2 C7.2 U1.4 U1.32), P15-EXP_IO (con12.10 con12.12)
VDD33_LCD: P07-LCD (7 pins), P15-EXP_IO (CON11.79 CON11.80)
VDD_ETHNET_1.8: P04-NET (C38.1 C39.1 U8.3 U8.10), P16-Connector (J2.9 J2.10)
VDD_TF: P15-EXP_IO (CON10.31), P16-Connector (J2.37 J2.38)
VSYS: P02-DC_JACK (7 pins), P03-UARTs_KEY (R105.2 R106.2), P04-NET (R31.2), P07-LCD (5 pins), P09-USB_JTAG (C87.1 C88.1), P15-EXP_IO (6 pins), P16-Connector (J2.35 J2.36)
AV1_IN: P11-CAMERA AVIN (5 pins), P16-Connector (J3.35 J3.36)
AV2_IN: P11-CAMERA AVIN (5 pins), P16-Connector (J3.39 J3.40)
BUF_GPS_RXD: P03-UARTs_KEY (R21.1), P04-NET (U9.12)
BUF_GPS_TXD: P03-UARTs_KEY (R20.1), P04-NET (U9.16)
BUF_XuRXD2/UART_AUDIO_RXD: P03-UARTs_KEY (U4.12), P04-NET (U9.13)
BUF_XuTXD2/UART_AUDIO_TXD: P03-UARTs_KEY (U4.11), P04-NET (U9.8)
CAM2M_PWDN: P11-CAMERA AVIN (U1.28), P15-EXP_IO (CON11.46)
CAM2M_RST: P11-CAMERA AVIN (U1.8), P15-EXP_IO (CON11.44)
CAM_D0: P11-CAMERA AVIN (U1.18), P15-EXP_IO (CON11.30)
CAM_D1: P11-CAMERA AVIN (U1.17), P15-EXP_IO (CON11.29)
CAM_D2: P11-CAMERA AVIN (U1.16), P15-EXP_IO (CON11.32)
CAM_D3: P11-CAMERA AVIN (U1.15), P15-EXP_IO (CON11.31)
CAM_D4: P11-CAMERA AVIN (U1.14), P15-EXP_IO (CON11.34)
CAM_D5: P11-CAMERA AVIN (U1.13), P15-EXP_IO (CON11.33)
CAM_D6: P11-CAMERA AVIN (U1.12), P15-EXP_IO (CON11.36)
CAM_D7: P11-CAMERA AVIN (R24.1 R43.1 U1.11), P15-EXP_IO (CON11.35)
CAM_HREF: P11-CAMERA AVIN (R17.2 R18.2), P15-EXP_IO (CON11.27)
CAM_PCLK: P11-CAMERA AVIN (U1.9), P15-EXP_IO (CON11.39)
CAM_VSYNC: P11-CAMERA AVIN (U1.24), P15-EXP_IO (CON11.42)
CHG_EN: P07-LCD (R7.2), P15-EXP_IO (CON11.52)
GPC1_1: P04-NET (U9.38), P15-EXP_IO (CON13.7)
GPS_RST: P04-NET (U9.46), P15-EXP_IO (con12.61)
GPS_RXD: P04-NET (U9.37), P15-EXP_IO (con12.57)
GPS_TXD: P04-NET (U9.33), P15-EXP_IO (con12.59)
I2C_SCL6: P04-NET (U9.40), P15-EXP_IO (CON11.43)
I2C_SCL7: P11-CAMERA AVIN (R28.1 U1.21), P15-EXP_IO (CON11.38)
I2C_SDA6: P04-NET (U9.32), P15-EXP_IO (CON11.45)
I2C_SDA7: P11-CAMERA AVIN (R27.1 U1.22), P15-EXP_IO (CON11.37)
KP_COL0: P03-UARTs_KEY (R1.2), P15-EXP_IO (CON11.54)
LCD_DEN: P07-LCD (U12.30), P15-EXP_IO (con12.21)
LCD_HSYNC: P07-LCD (U12.27), P15-EXP_IO (con12.18)
LCD_PWDN: P07-LCD (U12.32), P15-EXP_IO (con12.46)
LCD_VD2: P07-LCD (U12.15), P15-EXP_IO (con12.25)
LCD_VD3: P07-LCD (U12.19), P15-EXP_IO (con12.24)
LCD_VD4: P07-LCD (U12.20), P15-EXP_IO (con12.27)
LCD_VD5: P07-LCD (U12.22), P15-EXP_IO (con12.26)
LCD_VD6: P07-LCD (U12.23), P15-EXP_IO (con12.29)
LCD_VD7: P07-LCD (U12.24), P15-EXP_IO (con12.28)
LCD_VD10: P07-LCD (U12.4), P15-EXP_IO (con12.33)
LCD_VD11: P07-LCD (U12.6), P15-EXP_IO (con12.32)
LCD_VD12: P07-LCD (U12.7), P15-EXP_IO (con12.35)
LCD_VD13: P07-LCD (U12.11), P15-EXP_IO (con12.34)
LCD_VD14: P07-LCD (U12.12), P15-EXP_IO (con12.37)
LCD_VD15: P07-LCD (U12.14), P15-EXP_IO (con12.36)
LCD_VD18: P07-LCD (U12.51), P15-EXP_IO (con12.41)
LCD_VD19: P07-LCD (U12.52), P15-EXP_IO (con12.40)
LCD_VD20: P07-LCD (U12.54), P15-EXP_IO (con12.43)
LCD_VD21: P07-LCD (U12.55), P15-EXP_IO (con12.42)
LCD_VD22: P07-LCD (U12.56), P15-EXP_IO (con12.45)
LCD_VD23: P07-LCD (U12.3), P15-EXP_IO (con12.44)
LCD_VOTCLK: P07-LCD (U12.31), P15-EXP_IO (con12.19)
LCD_VSYNC: P07-LCD (U12.28), P15-EXP_IO (con12.20)
LINK&ACT: P04-NET (U8.28), P16-Connector (J2.13 J2.14)
MD_USBDN: P09-USB_JTAG (R129.2), P15-EXP_IO (CON10.13), P16-Connector (J2.29 J2.30)
MD_USBDP: P09-USB_JTAG (R128.2), P15-EXP_IO (CON10.11), P16-Connector (J2.27 J2.28)
PWRDN_VCM: P04-NET (U9.43), P15-EXP_IO (CON11.50)
PWRON: P02-DC_JACK (SW1.3 SW1.4), P15-EXP_IO (CON10.63)
RS232_RXD1: P03-UARTs_KEY (U4.13), P16-Connector (J3.23 J3.24)
RS232_RXD2: P03-UARTs_KEY (U4.8), P16-Connector (J3.27 J3.28)
RS232_TXD1: P03-UARTs_KEY (U4.14), P16-Connector (J3.25 J3.26)
RS232_TXD2: P03-UARTs_KEY (U4.7), P16-Connector (J3.29 J3.30)
RX+: P04-NET (R34.1 U8.4), P16-Connector (J2.19 J2.20)
RX-: P04-NET (R35.1 U8.5), P16-Connector (J2.17 J2.18)
sPEED: P04-NET (U8.29), P16-Connector (J2.15 J2.16)
STM_LCD_ONOFF: P07-LCD (R51.1), P16-Connector (J3.15 J3.16)
STM_LCD_PWM: P07-LCD (R52.1), P16-Connector (J3.17 J3.18)
TP1_EN: P07-LCD (R22.1), P15-EXP_IO (con12.50)
TP1_INT: P07-LCD (U2.4), P15-EXP_IO (con12.48)
TP_IOCTL: P04-NET (U9.47), P15-EXP_IO (con12.53)
TX+: P04-NET (R37.1 U8.8), P16-Connector (J2.23 J2.24)
TX-: P04-NET (R38.1 U8.9), P16-Connector (J2.21 J2.22)
UH_DM2: P04-NET (U8.40), P15-EXP_IO (CON10.22)
UH_DM3: P09-USB_JTAG (R120.2), P15-EXP_IO (CON10.19), P16-Connector (J2.33 J2.34)
UH_DP2: P04-NET (U8.41), P15-EXP_IO (CON10.20)
UH_DP3: P09-USB_JTAG (R119.2), P15-EXP_IO (CON10.17), P16-Connector (J2.31 J2.32)
VDD50_EN: P03-UARTs_KEY (R2.2), P15-EXP_IO (CON10.73)
XEINT7/GPX0_7: P15-EXP_IO (CON10.32), P16-Connector (J2.39 J2.40)
XEINT30/HDMI_CEC/ALV_DBG26: P07-LCD (U2.5), P15-EXP_IO (CON11.22)
Xmmc2CLK: P15-EXP_IO (CON10.26), P16-Connector (J2.47 J2.48)
Xmmc2CMD: P15-EXP_IO (CON10.23), P16-Connector (J2.45 J2.46)
Xmmc2DATA0: P15-EXP_IO (CON10.28), P16-Connector (J2.49 J2.50)
Xmmc2DATA1: P15-EXP_IO (CON10.30), P16-Connector (J2.51 J2.52)
Xmmc2DATA2: P15-EXP_IO (CON10.25), P16-Connector (J2.41 J2.42)
Xmmc2DATA3: P15-EXP_IO (CON10.27), P16-Connector (J2.43 J2.44)
XPWMTOUT1: P04-NET (R25.2), P15-EXP_IO (CON13.5)
XuCTSn2/I2C_3_SDA: P07-LCD (U17.4), P15-EXP_IO (con12.51)
XuotgDM: P09-USB_JTAG (CON7.2), P15-EXP_IO (CON10.16)
XuotgDP: P09-USB_JTAG (CON7.3), P15-EXP_IO (CON10.14)
XuotgID: P09-USB_JTAG (CON7.4), P15-EXP_IO (CON10.12)
XuotgVBUS: P09-USB_JTAG (C89.2 CON7.1), P15-EXP_IO (CON11.24)
XuRTSn2/I2C_3_SCL: P07-LCD (U17.5), P15-EXP_IO (con12.49)
XuRXD1: P04-NET (U9.29), P15-EXP_IO (con12.60)
XuRXD2/UART_AUDIO_RXD: P04-NET (U9.36), P15-EXP_IO (con12.54)
XuTXD2/UART_AUDIO_TXD: P04-NET (U9.41), P15-EXP_IO (con12.56)